# EAGLE schematic cs_debug_v1.1 (EAGLE 9.6.1)

## Sheet 1 of 3
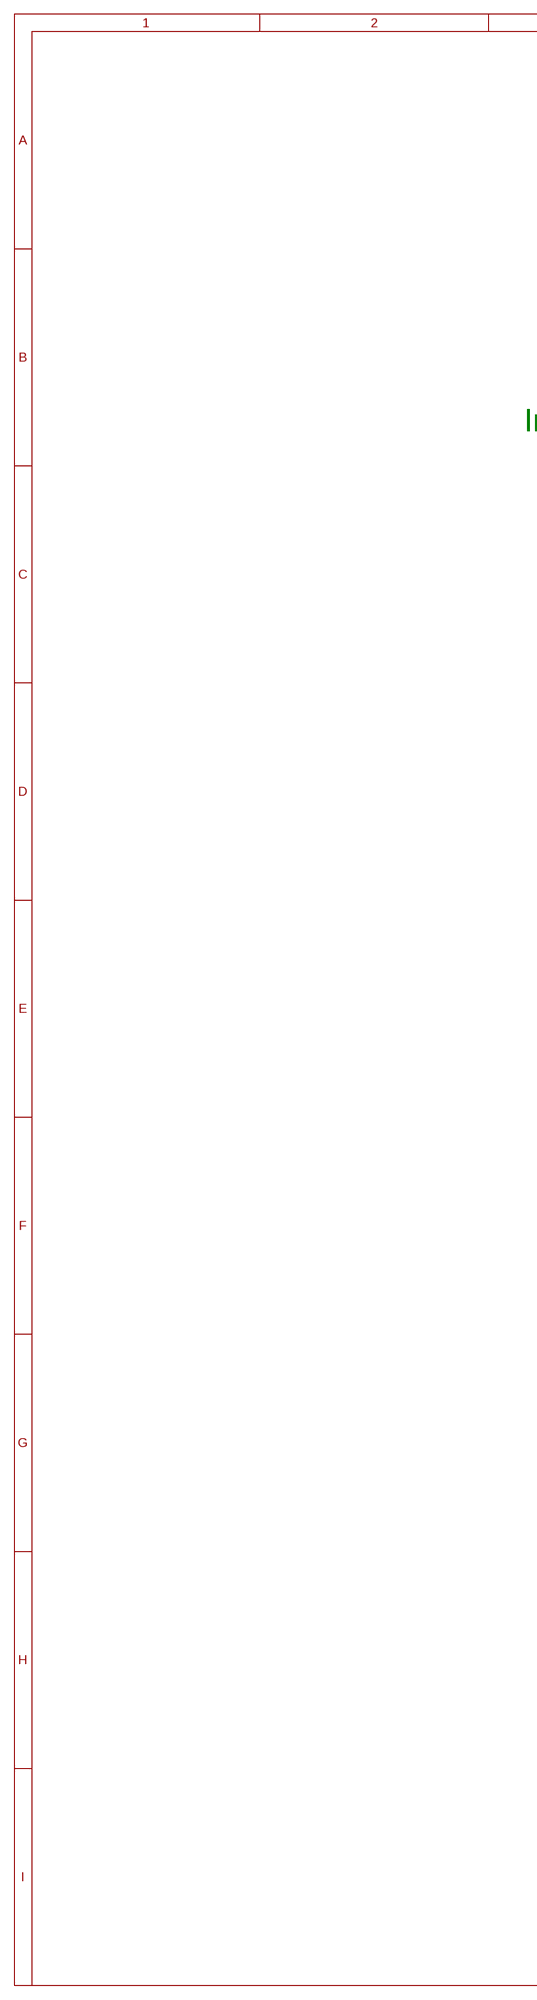
[diagram p0: schematic, sheet 1, part 1 of 3]
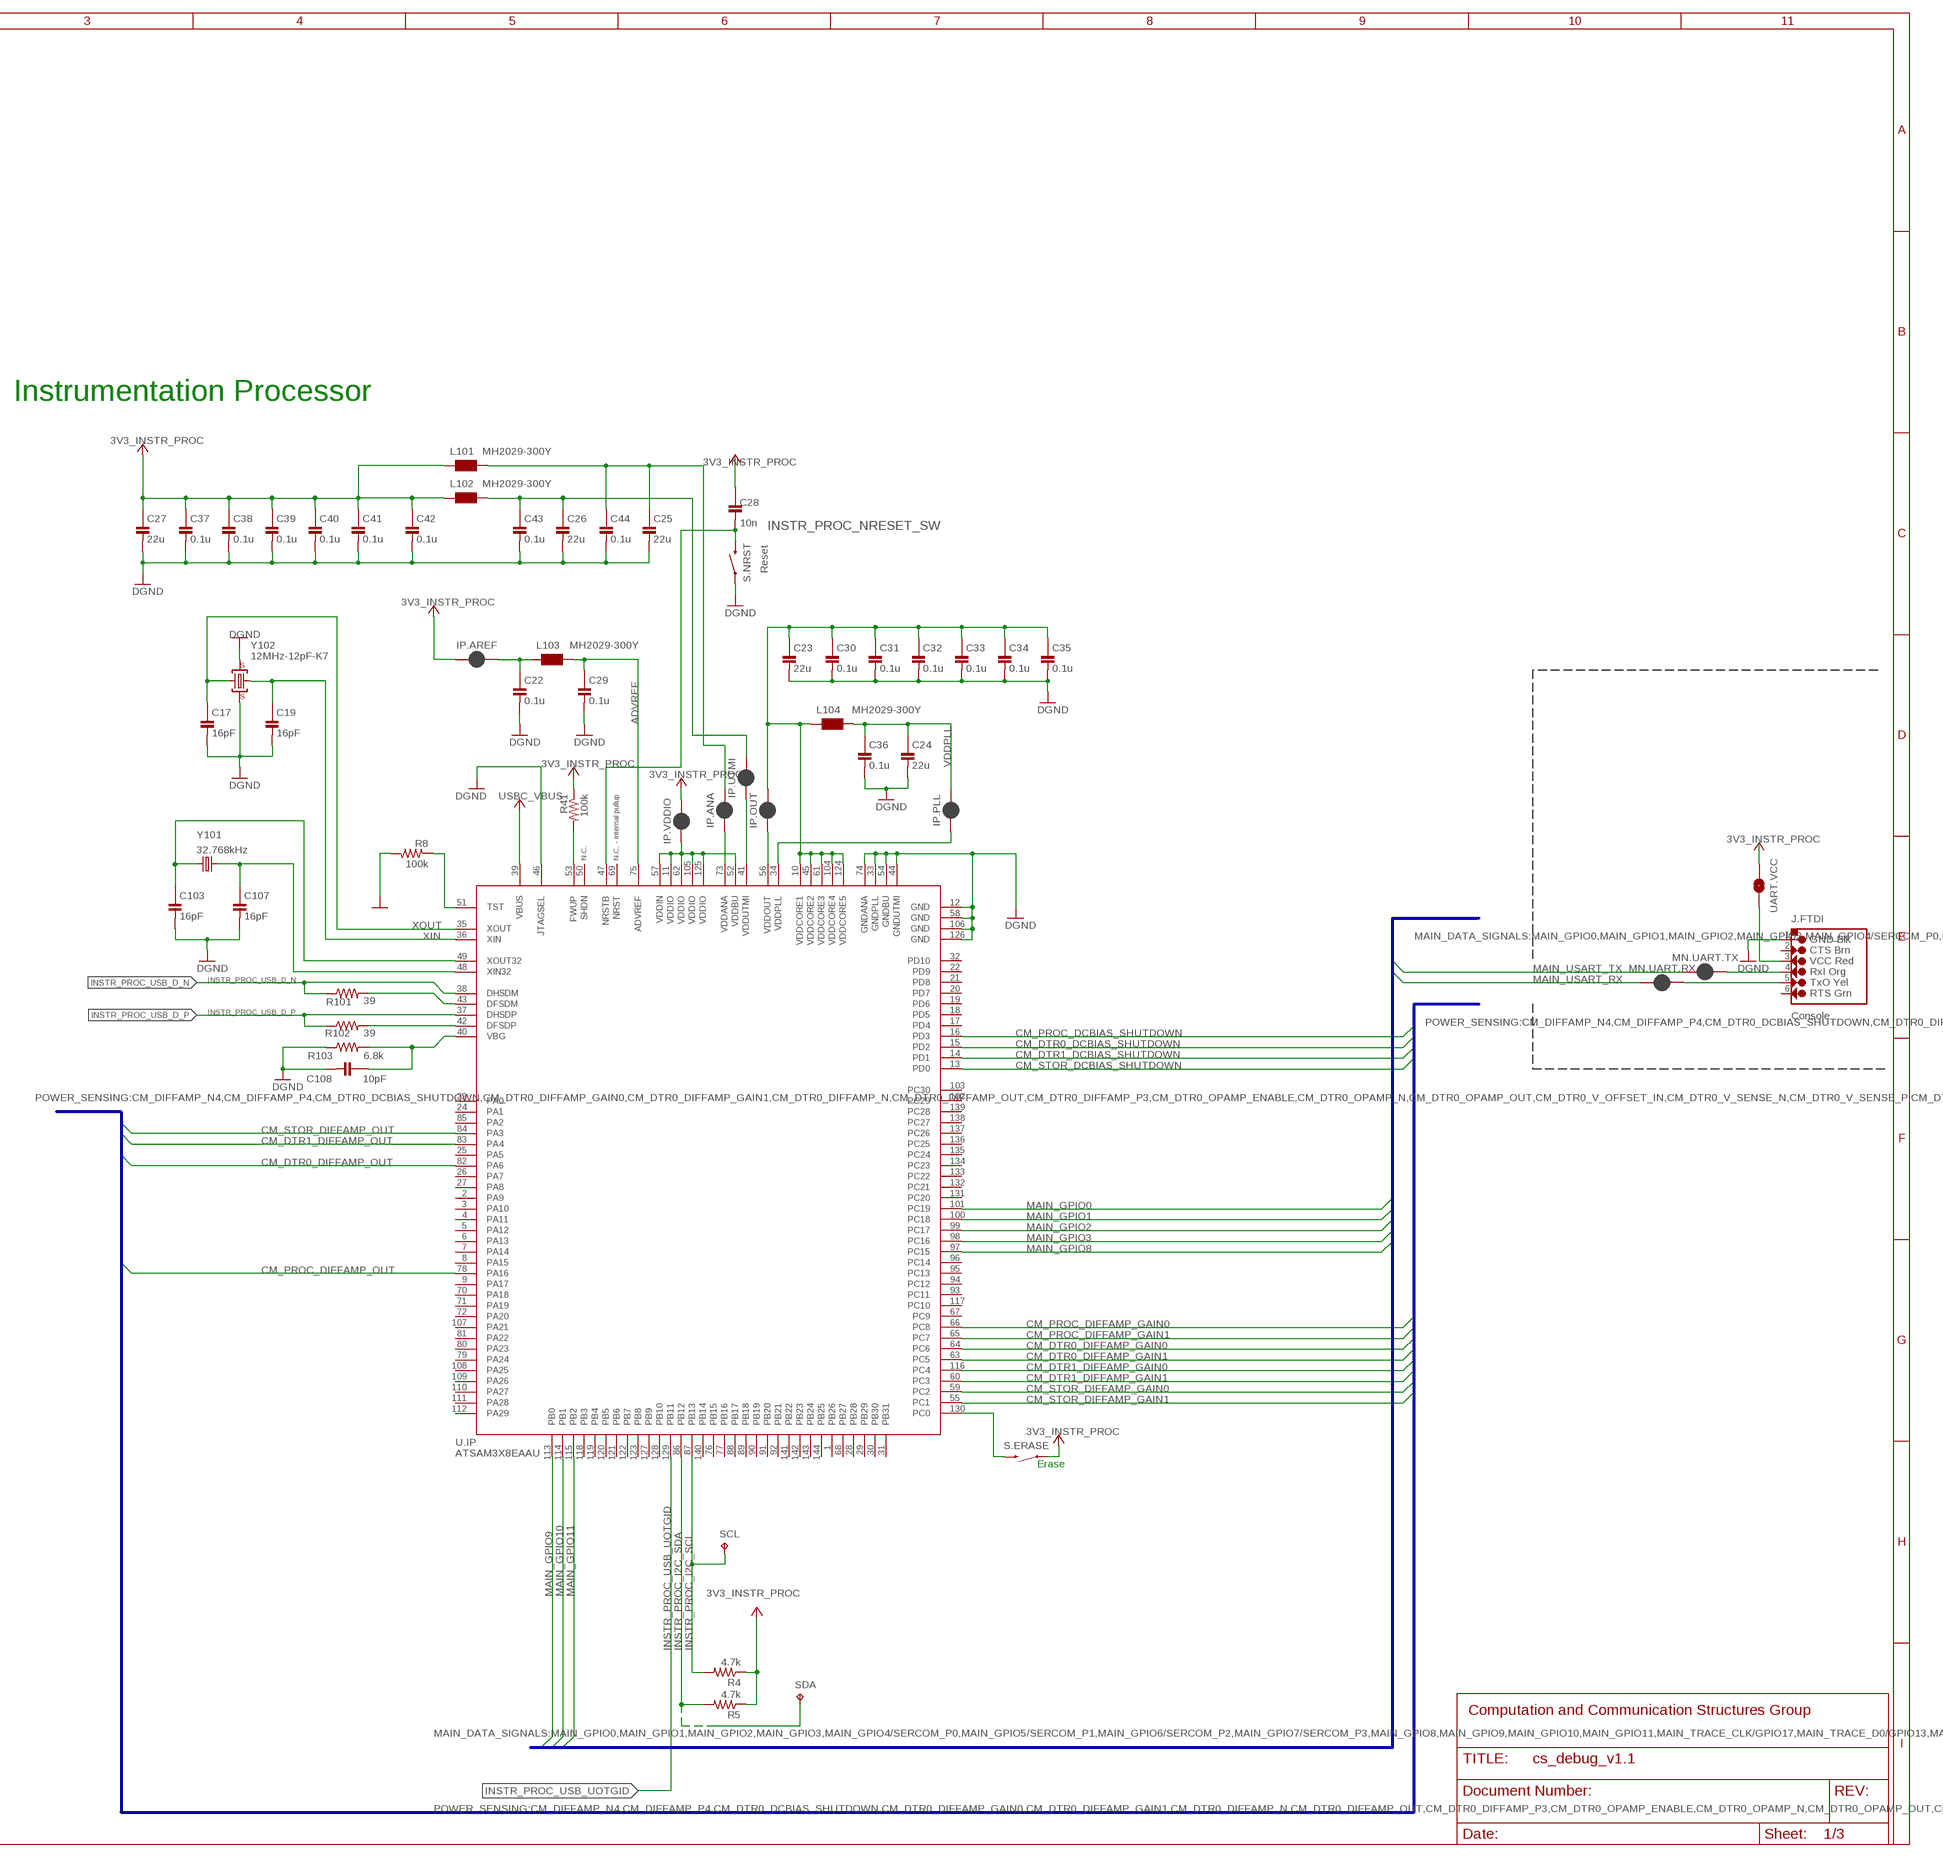
[diagram p1: schematic, sheet 1, part 2 of 3]
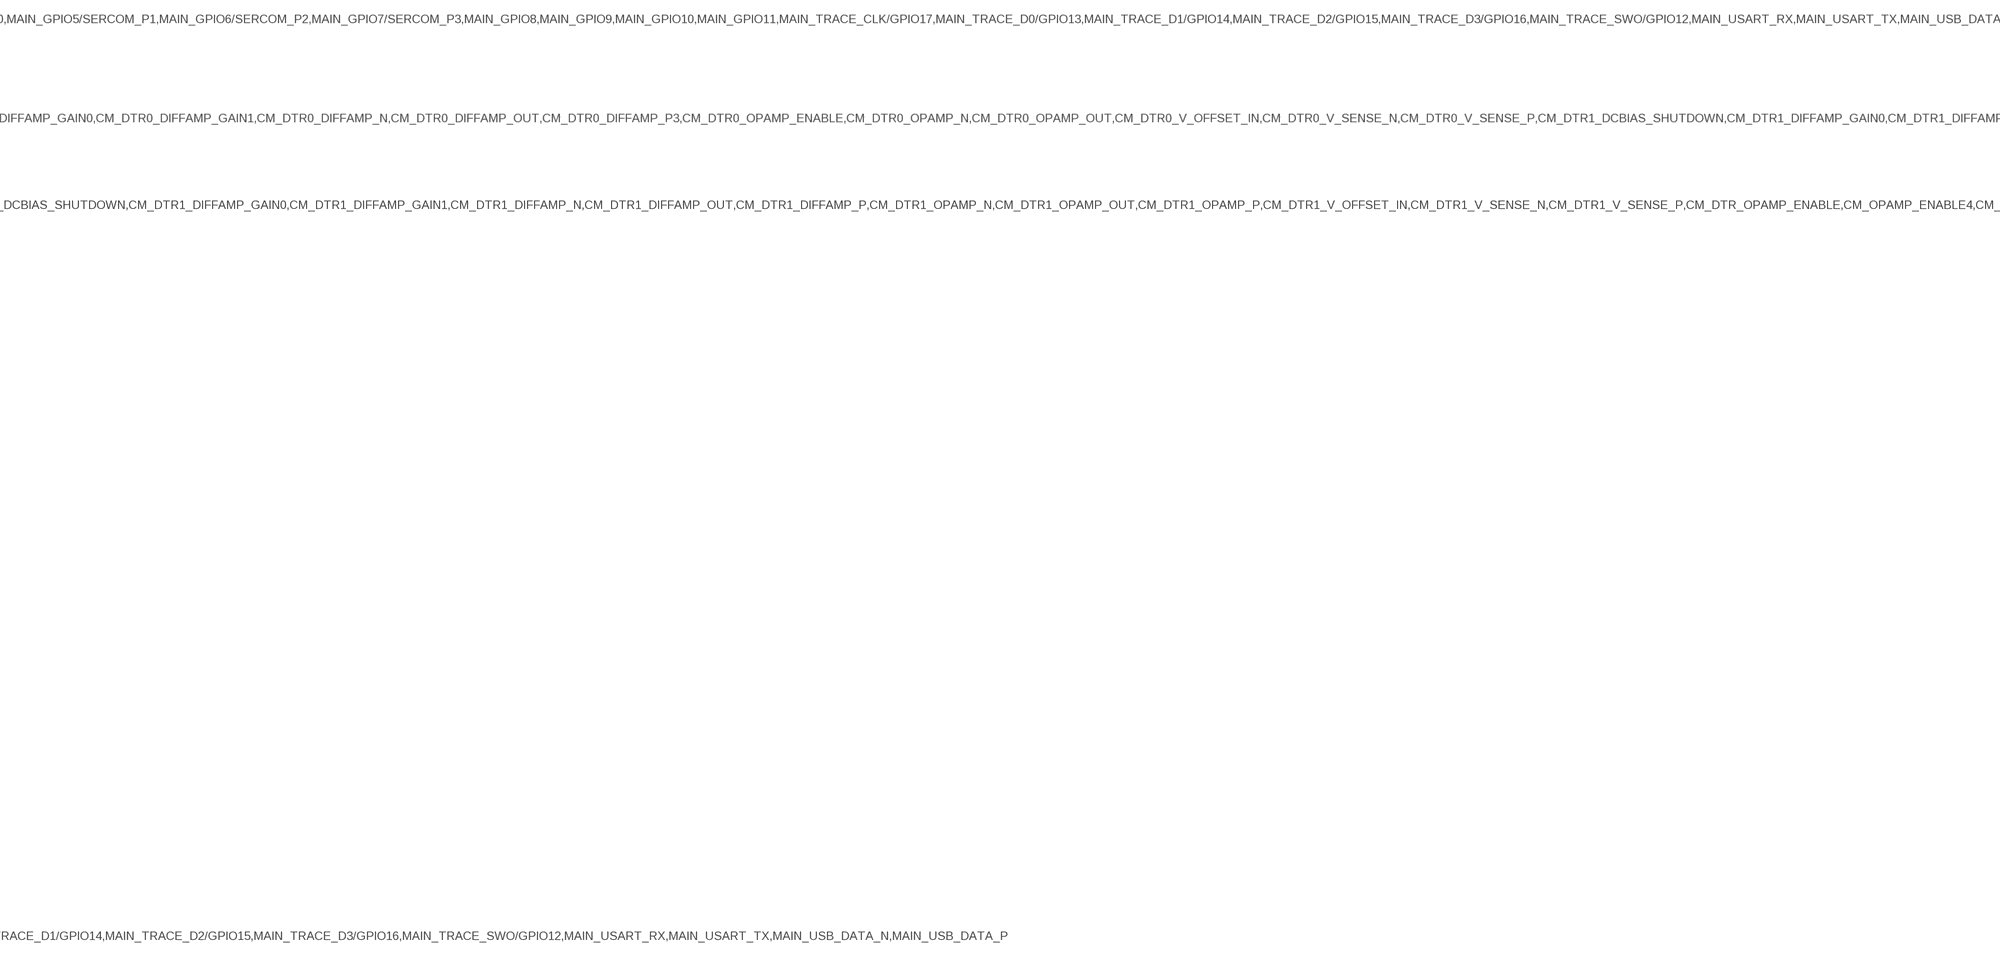
[diagram p2: schematic, sheet 1, part 3 of 3]

### Parts
C17  16pF  C-0603  [C0603]
C19  16pF  C-0603  [C0603]
C22  0.1u  C-0402  [C0402]
C23  22u  C-0805  [C0805]
C24  22u  C-0805  [C0805]
C25  22u  C-0805  [C0805]
C26  22u  C-0805  [C0805]
C27  22u  C-0805  [C0805]
C28  10n  C-0402  [C0402]
C29  0.1u  C-0402  [C0402]
C30  0.1u  C-0402  [C0402]
C31  0.1u  C-0402  [C0402]
C32  0.1u  C-0402  [C0402]
C33  0.1u  C-0402  [C0402]
C34  0.1u  C-0402  [C0402]
C35  0.1u  C-0402  [C0402]
C36  0.1u  C-0402  [C0402]
C37  0.1u  C-0402  [C0402]
C38  0.1u  C-0402  [C0402]
C39  0.1u  C-0402  [C0402]
C40  0.1u  C-0402  [C0402]
C41  0.1u  C-0402  [C0402]
C42  0.1u  C-0402  [C0402]
C43  0.1u  C-0402  [C0402]
C44  0.1u  C-0402  [C0402]
C103  16pF  C-0603  [C0603]
C107  16pF  C-0603  [C0603]
C108  10pF  C-0603  [C0603]
IP.ANA  JUMPER-SMT_2_NC_PASTE_NO-SILK  [SMT-JUMPER_2_NC_PASTE_NO-SILK]
IP.AREF  JUMPER-SMT_2_NC_PASTE_NO-SILK  [SMT-JUMPER_2_NC_PASTE_NO-SILK]
IP.OUT  JUMPER-SMT_2_NC_PASTE_NO-SILK  [SMT-JUMPER_2_NC_PASTE_NO-SILK]
IP.PLL  JUMPER-SMT_2_NC_PASTE_NO-SILK  [SMT-JUMPER_2_NC_PASTE_NO-SILK]
IP.UTMI  JUMPER-SMT_2_NC_PASTE_NO-SILK  [SMT-JUMPER_2_NC_PASTE_NO-SILK]
IP.VDDIO  JUMPER-SMT_2_NC_PASTE_NO-SILK  [SMT-JUMPER_2_NC_PASTE_NO-SILK]
J.FTDI  J-SERIAL-PORT  [HEADER-1X6]
L101  MH2029-300Y  [L0805]
L102  MH2029-300Y  [L0805]
L103  MH2029-300Y  [L0805]
L104  MH2029-300Y  [L0805]
MN.UART.RX  JUMPER-SMT_2_NC_PASTE_NO-SILK  [SMT-JUMPER_2_NC_PASTE_NO-SILK]
MN.UART.TX  JUMPER-SMT_2_NC_PASTE_NO-SILK  [SMT-JUMPER_2_NC_PASTE_NO-SILK]
R4  4.7k  R-0402  [R0402]
R5  4.7k  R-0402  [R0402]
R8  100k  R-0402  [R0402]
R41  100k  R-0402  [R0402]
R101  39  R-0402  [R0402]
R102  39  R-0402  [R0402]
R103  6.8k  R-0402  [R0402]
S.ERASE  Momentary  MOMENTARY-SWITCH-SPST-SMD-5.2MM  [TACTILE_SWITCH_SMD_5.2MM]
S.NRST  Momentary  MOMENTARY-SWITCH-SPST-SMD-5.2MM  [TACTILE_SWITCH_SMD_5.2MM]
SCL  TPTP10SQ  [TP10SQ]
SDA  TPTP10SQ  [TP10SQ]
U.IP  ATSAM3X8EA-AU  ATSAM3X8EAAU  [LQFP144]
UART.VCC  JUMPER-SMT_2_NO_PASTEFREE  [SMT-JUMPER_2_NO_PASTEFREE_NO-SILK]
Y101  32.768kHz  CRYSTAL3.2X1.5MM  [CRYSTAL-SMD-3.2X1.5MM]
Y102  12MHz-12pF-K7  0396_12MHZ-12PF-K7  [CRYSTAL-3.2-2.5]

### Nets
3V3_INSTR_PROC [power]: C27.1 C28.1 C37.1 C38.1 C39.1 C40.1 C41.1 C42.1 IP.AREF.1 IP.VDDIO.2 L101.1 L102.1 R4.1 R5.1 R41.1 S.ERASE.1 UART.VCC.1 ; supply symbol labelled +3V3 ; also sheet 2
ADVREF [power]: C29.1 L103.2 U.IP.75(ADVREF)
ADVREF_PRE [power]: C22.1 IP.AREF.2 L103.1
CM_DTR0_DCBIAS_SHUTDOWN: U.IP.15(PD2) ; also sheet 3
CM_DTR0_DIFFAMP_GAIN0: U.IP.64(PC6) ; also sheet 3
CM_DTR0_DIFFAMP_GAIN1: U.IP.63(PC5) ; also sheet 3
CM_DTR0_DIFFAMP_OUT: U.IP.82(PA6) ; also sheet 3
CM_DTR1_DCBIAS_SHUTDOWN: U.IP.14(PD1) ; also sheet 3
CM_DTR1_DIFFAMP_GAIN0: U.IP.116(PC4) ; also sheet 3
CM_DTR1_DIFFAMP_GAIN1: U.IP.60(PC3) ; also sheet 3
CM_DTR1_DIFFAMP_OUT: U.IP.83(PA4) ; also sheet 3
CM_PROC_DCBIAS_SHUTDOWN: U.IP.16(PD3) ; also sheet 3
CM_PROC_DIFFAMP_GAIN0: U.IP.66(PC8) ; also sheet 3
CM_PROC_DIFFAMP_GAIN1: U.IP.65(PC7) ; also sheet 3
CM_PROC_DIFFAMP_OUT: U.IP.78(PA16) ; also sheet 3
CM_STOR_DCBIAS_SHUTDOWN: U.IP.13(PD0) ; also sheet 3
CM_STOR_DIFFAMP_GAIN0: U.IP.59(PC2) ; also sheet 3
CM_STOR_DIFFAMP_GAIN1: U.IP.55(PC1) ; also sheet 3
CM_STOR_DIFFAMP_OUT: U.IP.84(PA3) ; also sheet 3
DGND [GND]: C17.2 C19.2 C22.2 C23.2 C24.2 C25.2 C26.2 C27.2 C29.2 C30.2 C31.2 C32.2 C33.2 C34.2 C35.2 C36.2 C37.2 C38.2 C39.2 C40.2 C41.2 C42.2 C43.2 C44.2 C103.2 C107.2 C108.2 J.FTDI.1(GND) R8.2 R103.1 S.NRST.1 U.IP.12(GND) U.IP.33(GNDPLL) U.IP.44(GNDUTMI) U.IP.46(JTAGSEL) U.IP.54(GNDBU) U.IP.58(GND) U.IP.74(GNDANA) U.IP.106(GND) U.IP.126(GND) Y102.2(GND) Y102.4(GND) ; supply symbol labelled GND ; also sheet 2
ERASE_S: S.ERASE.3 U.IP.130(PC0)
FWUP: R41.2 U.IP.53(FWUP)
INSTR_PROC_I2C_SCL: R4.2 SCL.TP U.IP.87(PB13) ; also sheet 3
INSTR_PROC_I2C_SDA: R5.2 SDA.TP U.IP.86(PB12) ; also sheet 3
INSTR_PROC_NRESET_SW: C28.2 S.NRST.3 U.IP.47(NRSTB)
INSTR_PROC_USB_D_N: R101.1 U.IP.38(DHSDM) ; also sheet 2
INSTR_PROC_USB_D_P: R102.1 U.IP.37(DHSDP) ; also sheet 2
INSTR_PROC_USB_UOTGID [power]: U.IP.129(PB11)
MAIN_GPIO0: U.IP.101(PC19) ; also sheet 2
MAIN_GPIO1: U.IP.100(PC18) ; also sheet 2
MAIN_GPIO2: U.IP.99(PC17) ; also sheet 2
MAIN_GPIO3: U.IP.98(PC16) ; also sheet 2
MAIN_GPIO8: U.IP.97(PC15) ; also sheet 2
MAIN_GPIO9: U.IP.113(PB0) ; also sheet 2
MAIN_GPIO10: U.IP.114(PB1) ; also sheet 2
MAIN_GPIO11: U.IP.115(PB2) ; also sheet 2
MAIN_USART_RX: MN.UART.RX.1 ; also sheet 2
MAIN_USART_TX: MN.UART.TX.1 ; also sheet 2
N$2: R102.2 U.IP.42(DFSDP)
N$7: J.FTDI.4(RX-I) MN.UART.TX.2
N$9: J.FTDI.5(TX-O) MN.UART.RX.2
N$11: J.FTDI.3(VCC-I) UART.VCC.2
N$13: R101.2 U.IP.43(DFSDM)
TST: R8.1 U.IP.51(TST)
USBC_VBUS [power]: U.IP.39(VBUS) ; supply symbol labelled +3V3 ; also sheet 2
VBG: C108.1 R103.2 U.IP.40(VBG)
VDDANA1 [power]: C25.1 C44.1 IP.ANA.2 L101.2
VDDANA_0 [power]: IP.ANA.1 U.IP.73(VDDANA)
VDDIO1 [power]: IP.VDDIO.1 U.IP.11(VDDIO) U.IP.52(VDDBU) U.IP.57(VDDIN) U.IP.62(VDDIO) U.IP.105(VDDIO) U.IP.125(VDDIO)
VDDOUT [power]: C23.1 C30.1 C31.1 C32.1 C33.1 C34.1 C35.1 IP.OUT.2 L104.1 U.IP.10(VDDCORE1) U.IP.45(VDDCORE2) U.IP.61(VDDCORE3) U.IP.104(VDDCORE4) U.IP.124(VDDCORE5)
VDDOUT_0 [power]: IP.OUT.1 U.IP.56(VDDOUT)
VDDOUTMI [power]: C26.1 C43.1 IP.UTMI.2 L102.2
VDDOUTMI_0 [power]: IP.UTMI.1 U.IP.41(VDDUTMI)
VDDPLL [power]: C24.1 C36.1 IP.PLL.2 L104.2
VDDPLL_0 [power]: IP.PLL.1 U.IP.34(VDDPLL)
XIN: C19.1 U.IP.36(XIN) Y102.1(C1)
XIN32: C107.1 U.IP.48(XIN32) Y101.P$1
XOUT: C17.1 U.IP.35(XOUT) Y102.3(C2)
XOUT32: C103.1 U.IP.49(XOUT32) Y101.P$2
Unconnected: J.FTDI.2(CTS-O) J.FTDI.6(RTS) U.IP.1(PB26) U.IP.2(PA9) U.IP.3(PA10) U.IP.4(PA11) U.IP.5(PA12) U.IP.6(PA13) U.IP.7(PA14) U.IP.8(PA15) U.IP.9(PA17) U.IP.17(PD4) U.IP.18(PD5) U.IP.19(PD6) U.IP.20(PD7) U.IP.21(PD8) U.IP.22(PD9) U.IP.23(PA0) U.IP.24(PA1) U.IP.25(PA5) U.IP.26(PA7) U.IP.27(PA8) U.IP.28(PB28) U.IP.29(PB29) U.IP.30(PB30) U.IP.31(PB31) U.IP.32(PD10) U.IP.50(SHDN) U.IP.67(PC9) U.IP.68(PB27) U.IP.69(NRST) U.IP.70(PA18) U.IP.71(PA19) U.IP.72(PA20) U.IP.76(PB15) U.IP.77(PB16) U.IP.79(PA24) U.IP.80(PA23) U.IP.81(PA22) U.IP.85(PA2) U.IP.88(PB17) U.IP.89(PB18) U.IP.90(PB19) U.IP.91(PB20) U.IP.92(PB21) U.IP.93(PC11) U.IP.94(PC12) U.IP.95(PC13) U.IP.96(PC14) U.IP.102(PC29) U.IP.103(PC30) U.IP.107(PA21) U.IP.108(PA25) U.IP.109(PA26) U.IP.110(PA27) U.IP.111(PA28) U.IP.112(PA29) U.IP.117(PC10) U.IP.118(PB3) U.IP.119(PB4) U.IP.120(PB5) U.IP.121(PB6) U.IP.122(PB7) U.IP.123(PB8) U.IP.127(PB9) U.IP.128(PB10) U.IP.131(PC20) U.IP.132(PC21) U.IP.133(PC22) U.IP.134(PC23) U.IP.135(PC24) U.IP.136(PC25) U.IP.137(PC26) U.IP.138(PC27) U.IP.139(PC28) U.IP.140(PB14) U.IP.141(PB22) U.IP.142(PB23) U.IP.143(PB24) U.IP.144(PB25)

### Buses
POWER_SENSING:CM_DIFFAMP_N4,CM_DIFFAMP_P4,CM_DTR0_DCBIAS_SHUTDOWN,CM_DTR0_DIFFAMP_GAIN0,CM_DTR0_DIFFAMP_GAIN1,CM_DTR0_DIFFAMP_N,CM_DTR0_DIFFAMP_OUT,CM_DTR0_DIFFAMP_P3,CM_DTR0_OPAMP_ENABLE,CM_DTR0_OPAMP_N,CM_DTR0_OPAMP_OUT,CM_DTR0_V_OFFSET_IN,CM_DTR0_V_SENSE_N,CM_DTR0_V_SENSE_P,CM_DTR1_DCBIAS_SHUTDOWN,CM_DTR1_DIFFAMP_GAIN0,CM_DTR1_DIFFAMP_GAIN1,CM_DTR1_DIFFAMP_N,CM_DTR1_DIFFAMP_OUT,CM_DTR1_DIFFAMP_P,CM_DTR1_OPAMP_N,CM_DTR1_OPAMP_OUT,CM_DTR1_OPAMP_P,CM_DTR1_V_OFFSET_IN,CM_DTR1_V_SENSE_N,CM_DTR1_V_SENSE_P,CM_DTR_OPAMP_ENABLE,CM_OPAMP_ENABLE4,CM_OPAMP_N4,CM_OPAMP_OUT4,CM_OPAMP_P1,CM_OPAMP_P3,CM_OPAMP_P4,CM_PROC_DCBIAS_SHUTDOWN,CM_PROC_DIFFAMP_GAIN0,CM_PROC_DIFFAMP_GAIN1,CM_PROC_DIFFAMP_OUT,CM_PROC_V_OFFSET_IN,CM_PROC_V_SENSE_N,CM_PROC_V_SENSE_P,CM_STOR_DCBIAS_SHUTDOWN,CM_STOR_DIFFAMP_GAIN0,CM_STOR_DIFFAMP_GAIN1,CM_STOR_DIFFAMP_N1,CM_STOR_DIFFAMP_OUT,CM_STOR_DIFFAMP_P1,CM_STOR_OPAMP_ENABLE,CM_STOR_OPAMP_N,CM_STOR_OPAMP_OUT,CM_STOR_V_OFFSET_IN,CM_STOR_V_SENSE_N,CM_STOR_V_SENSE_P,V_SENSE_P
MAIN_DATA_SIGNALS:MAIN_GPIO0,MAIN_GPIO1,MAIN_GPIO2,MAIN_GPIO3,MAIN_GPIO4/SERCOM_P0,MAIN_GPIO5/SERCOM_P1,MAIN_GPIO6/SERCOM_P2,MAIN_GPIO7/SERCOM_P3,MAIN_GPIO8,MAIN_GPIO9,MAIN_GPIO10,MAIN_GPIO11,MAIN_TRACE_CLK/GPIO17,MAIN_TRACE_D0/GPIO13,MAIN_TRACE_D1/GPIO14,MAIN_TRACE_D2/GPIO15,MAIN_TRACE_D3/GPIO16,MAIN_TRACE_SWO/GPIO12,MAIN_USART_RX,MAIN_USART_TX,MAIN_USB_DATA_N,MAIN_USB_DATA_P

### Notes on the sheet
- Instrumentation Processor
- Reset
- N.C. | N.C. - internal pullup
- Erase
- Computation and Communication Structures Group

## Sheet 2 of 3
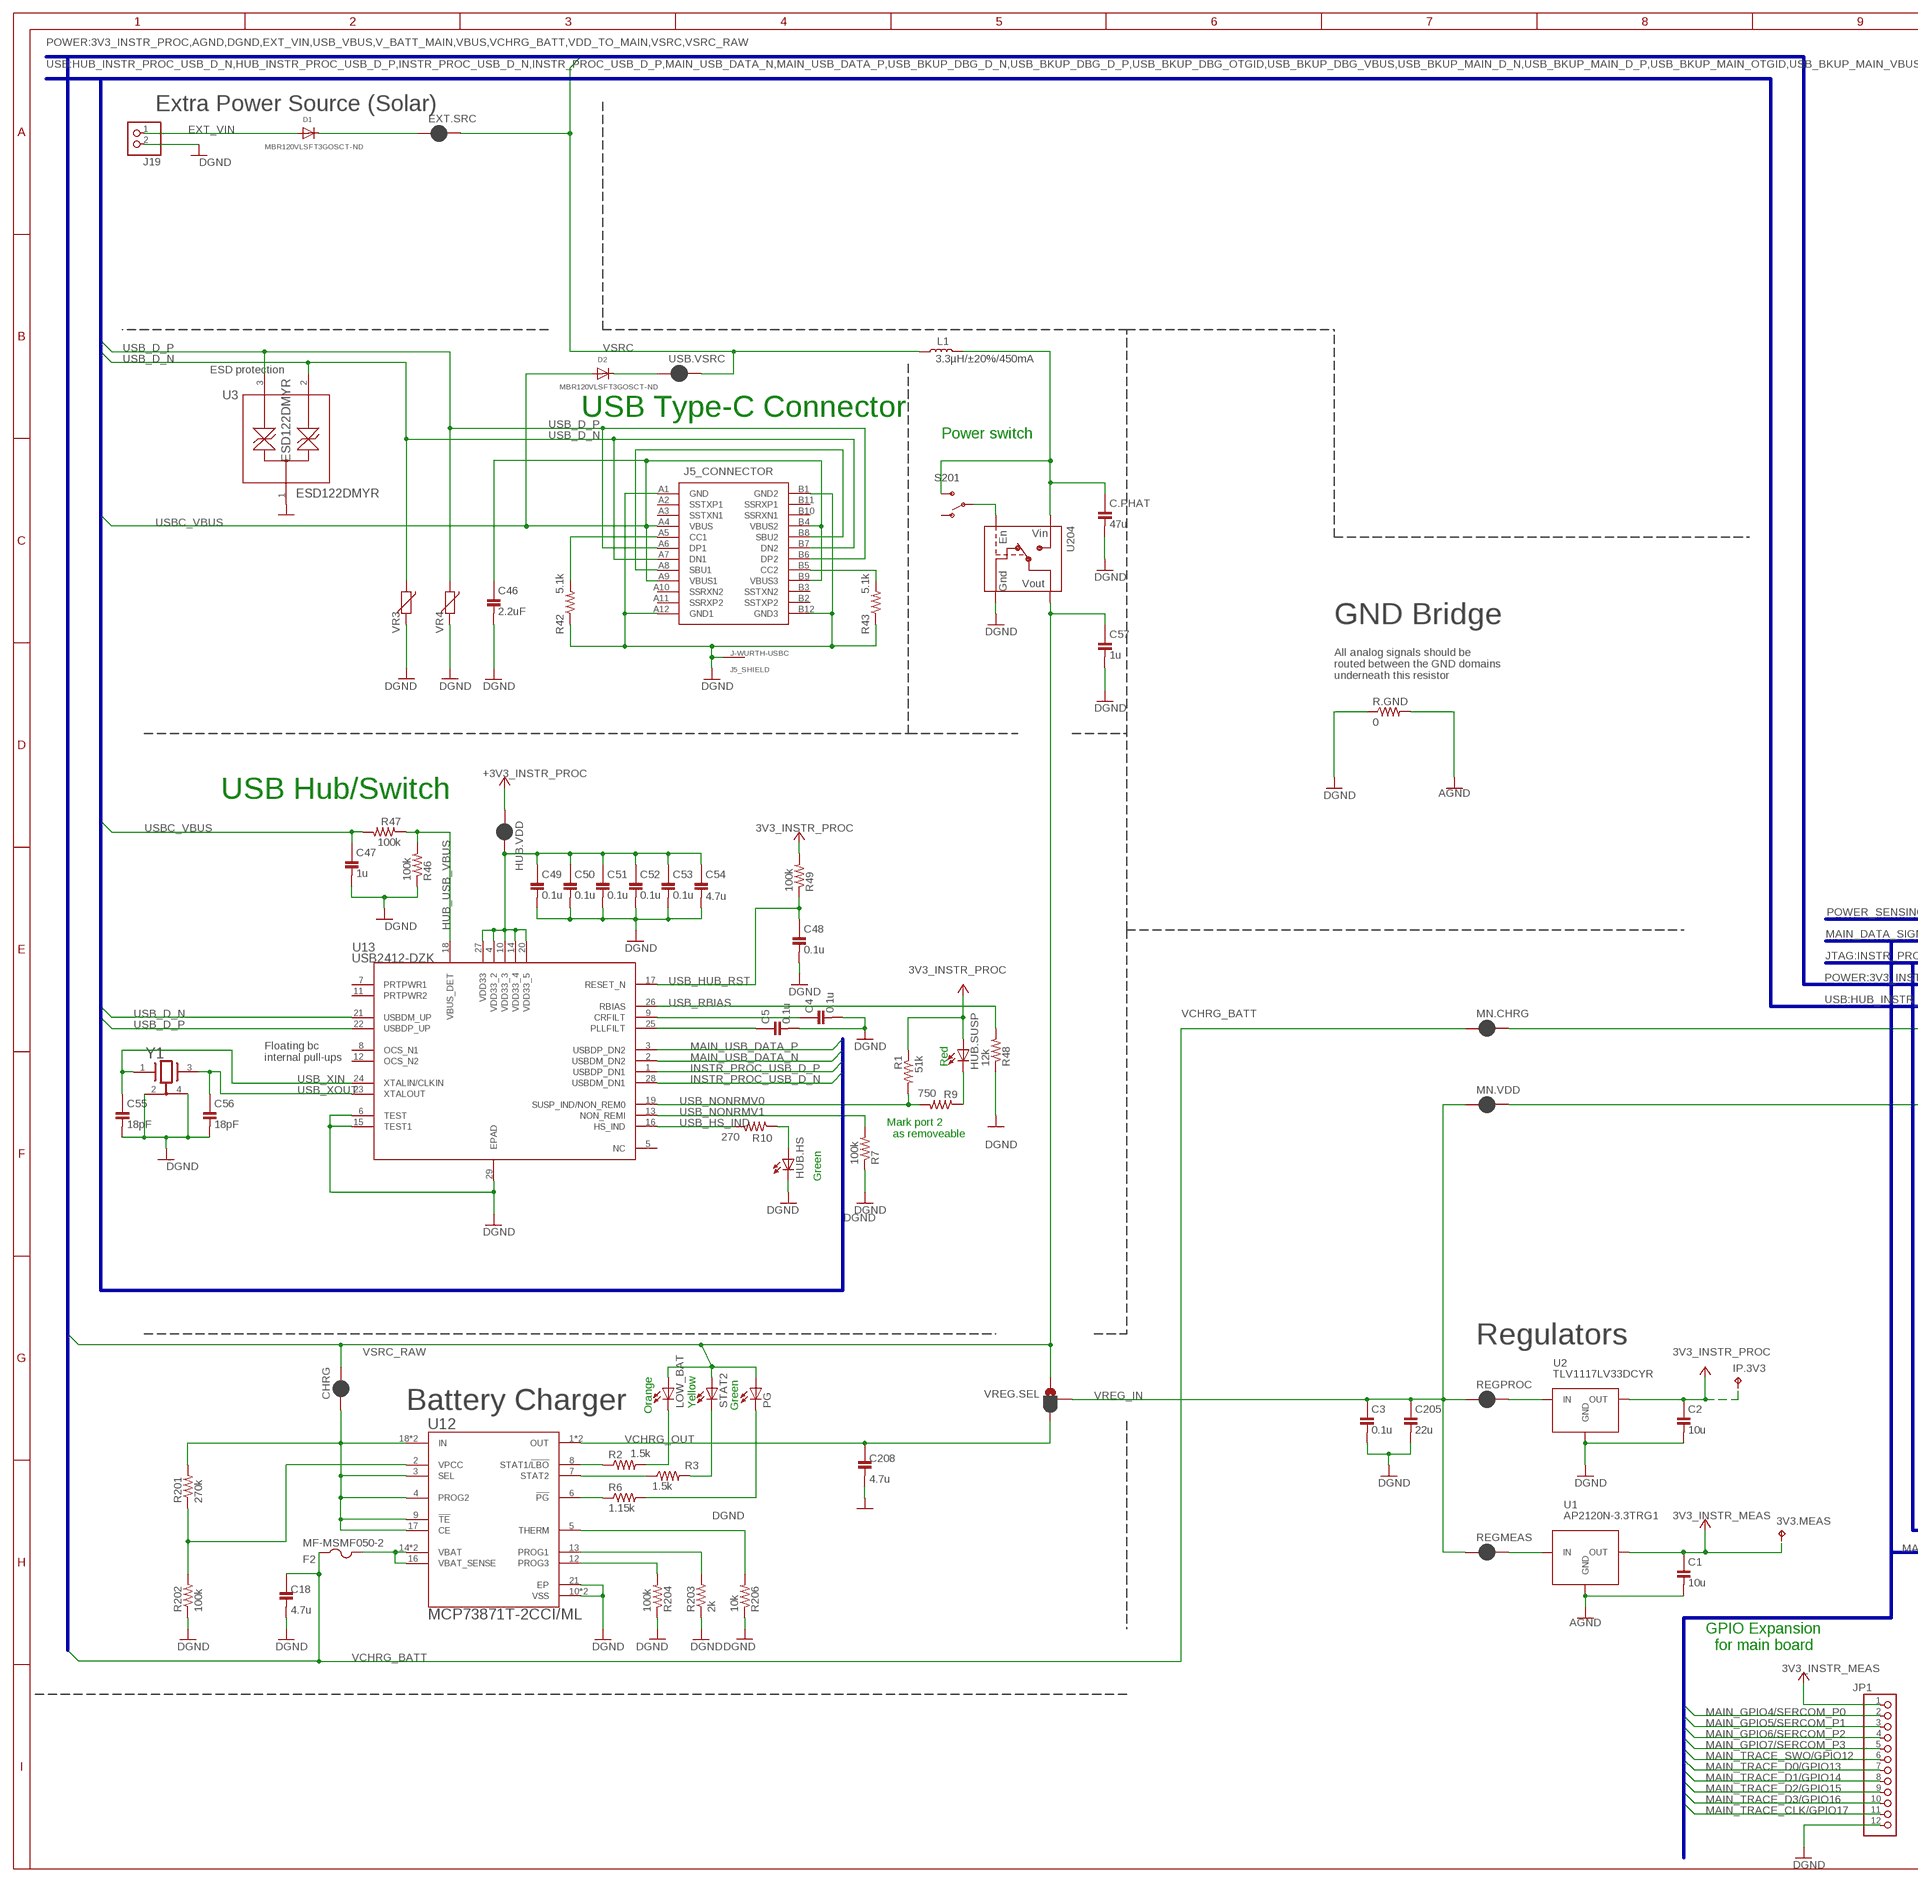
[diagram p3: schematic, sheet 2, part 1 of 2]
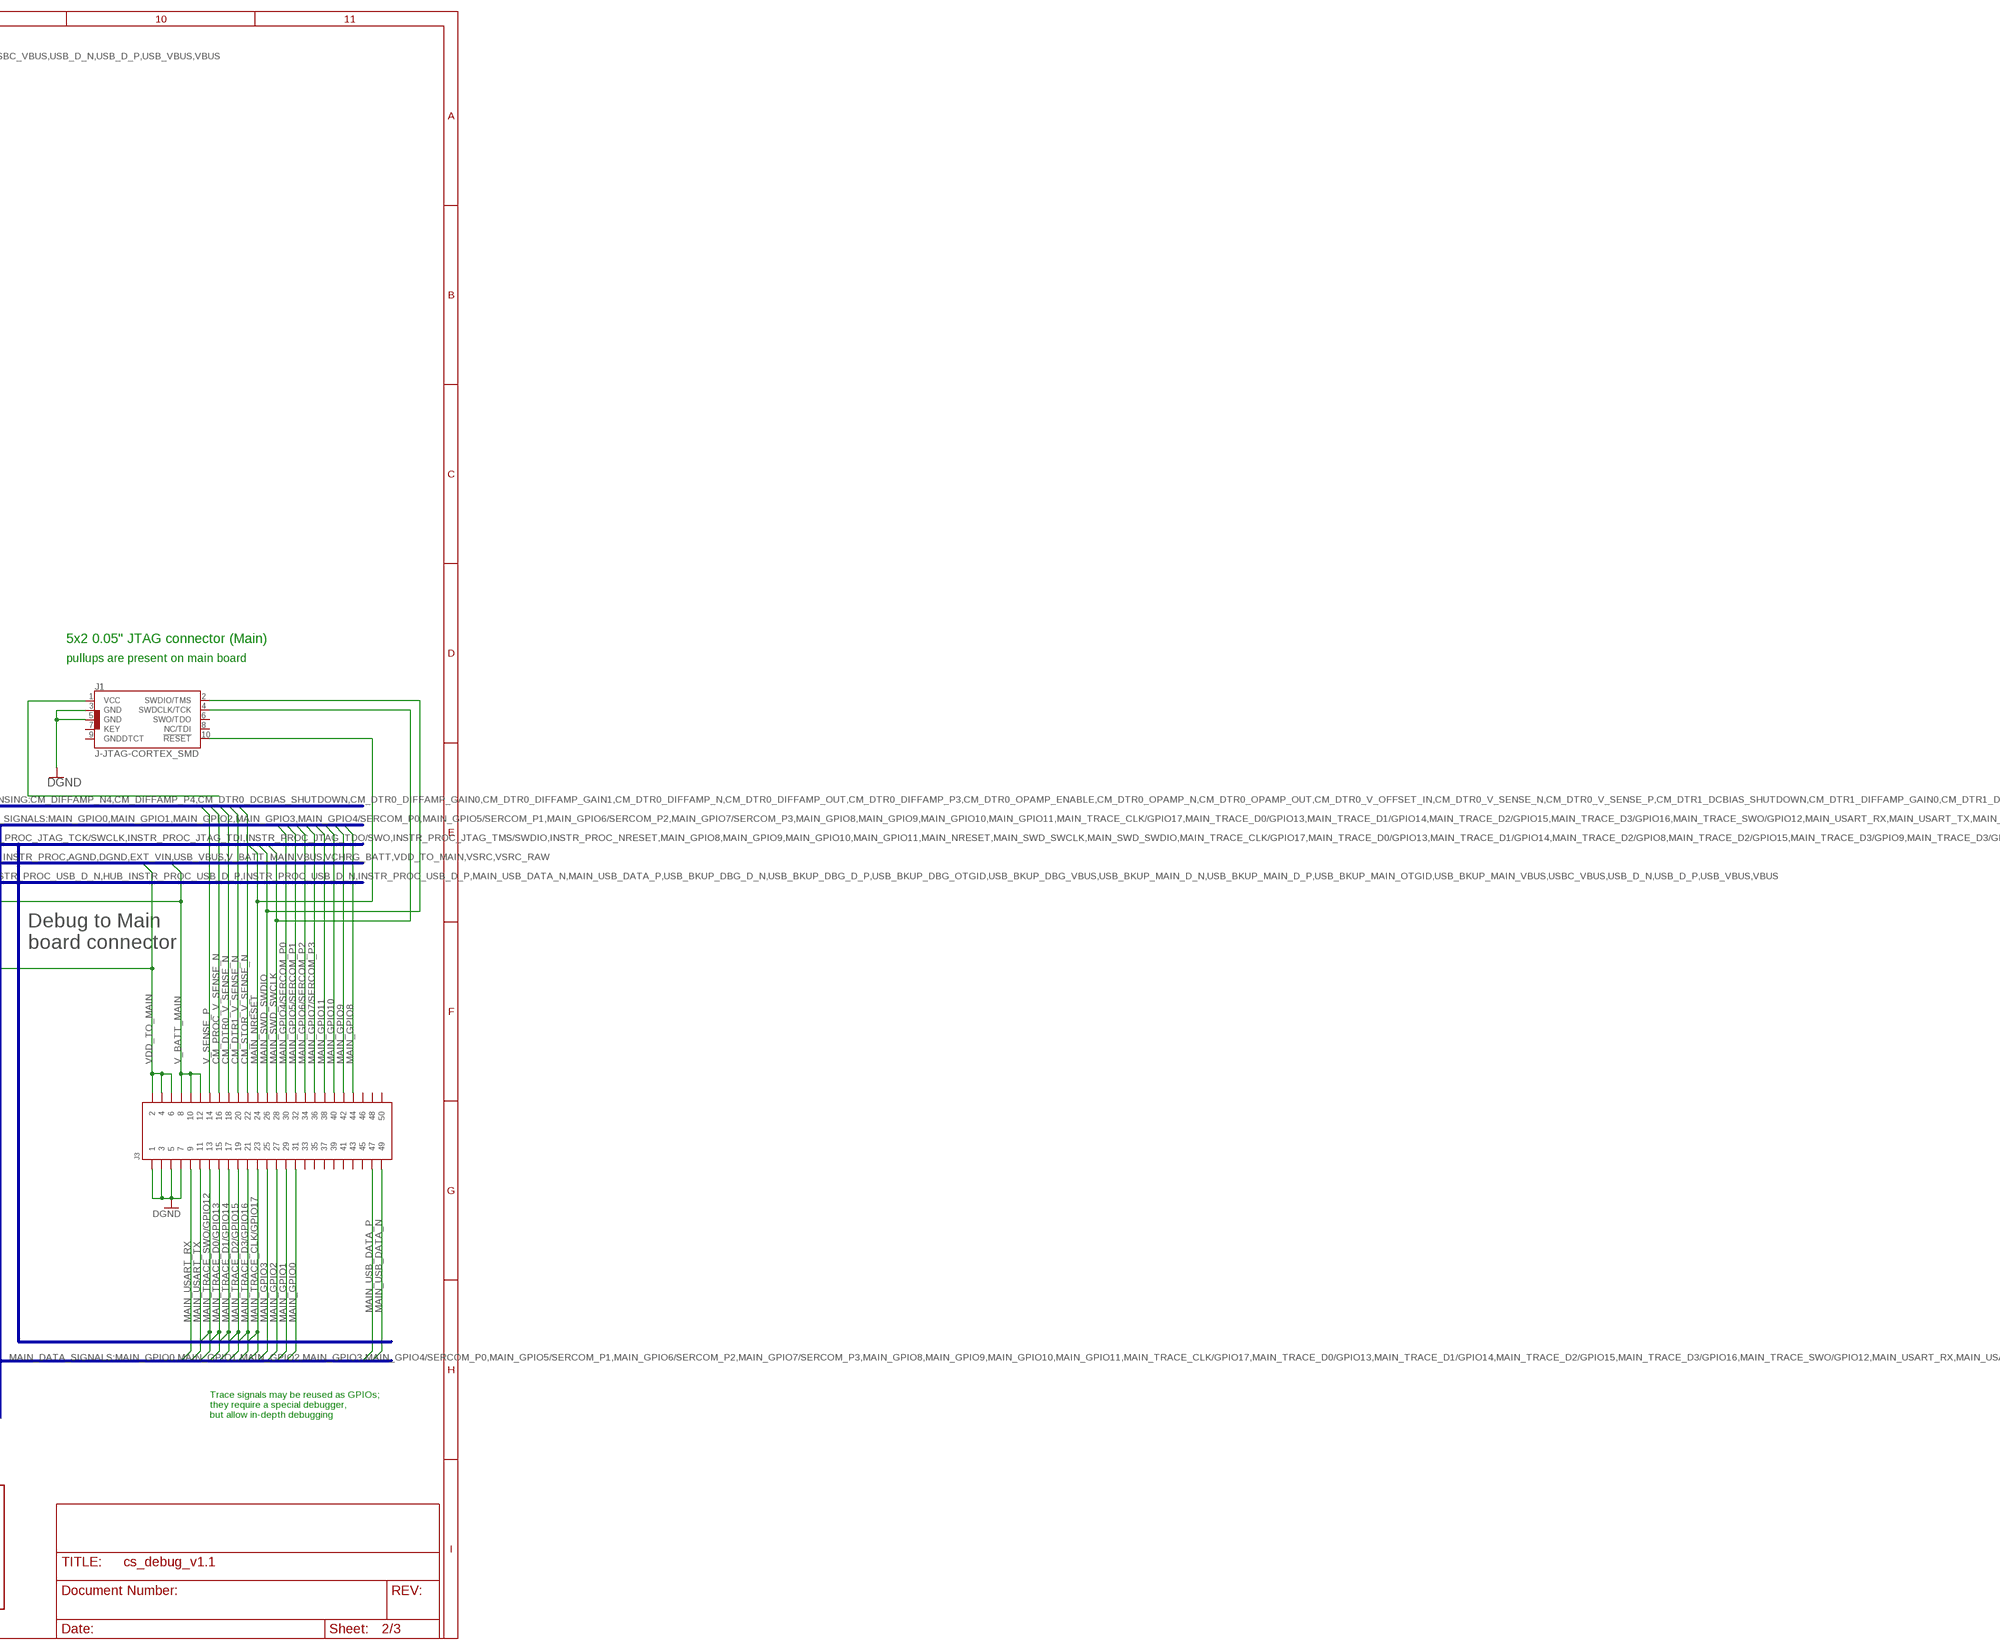
[diagram p4: schematic, sheet 2, part 2 of 2]

### Parts
3V3.MEAS  TPTP10SQ  [TP10SQ]
C1  10u  C-0805  [C0805]
C2  10u  C-0805  [C0805]
C3  0.1u  C-0402  [C0402]
C4  0.1u  C-0402  [C0402]
C5  0.1u  C-0402  [C0402]
C18  4.7u  C-0603  [C0603]
C46  2.2uF  C-0603  [C0603]
C47  1u  C-0402  [C0402]
C48  0.1u  C-0402  [C0402]
C49  0.1u  C-0402  [C0402]
C50  0.1u  C-0402  [C0402]
C51  0.1u  C-0402  [C0402]
C52  0.1u  C-0402  [C0402]
C53  0.1u  C-0402  [C0402]
C54  4.7u  C-0603  [C0603]
C55  18pF  C-0402  [C0402]
C56  18pF  C-0402  [C0402]
C57  1u  C-0402  [C0402]
C205  22u  C-0805  [C0805]
C208  4.7u  C-0603  [C0603]
C.PHAT  47u  C-1206  [C1206]
CHRG  JUMPER-SMT_2_NC_PASTE_NO-SILK  [SMT-JUMPER_2_NC_PASTE_NO-SILK]
D1  MBR120VLSFT3GOSCT-ND  DIODESOD-123  [SOD-123]
D2  MBR120VLSFT3GOSCT-ND  DIODESOD-123  [SOD-123]
EXT.SRC  JUMPER-SMT_2_NC_PASTE_NO-SILK  [SMT-JUMPER_2_NC_PASTE_NO-SILK]
F2  MF-MSMF050-2  PTCFUSE-1812  [1812]
HUB.HS  LEDCHIPLED_0603  [CHIPLED_0603]
HUB.SUSP  LEDCHIPLED_0603  [CHIPLED_0603]
HUB.VDD  JUMPER-SMT_2_NC_PASTE_NO-SILK  [SMT-JUMPER_2_NC_PASTE_NO-SILK]
IP.3V3  TPTP10SQ  [TP10SQ]
J1  J-JTAG-CORTEX_SMD  [SAMTECH_FTSH-105-01]
J3  HIROSE-DF40_50-PIN_CONNECTORS-HEADER  [HRS_DF40C-50DP-0.4V(51)]
J5  J-WURTH-USBC  [632723X00011]
J19  Solar  J-JST2-SMT-RA  [JST-PH-2-SMT-RA]
JP1  J-HEADER-1X12  [1X12_ROUND]
L1  3.3µH/±20%/450mA  INDUCTOR-0805-3.3UH  [0805]
LOW_BAT  LEDCHIPLED_0603  [CHIPLED_0603]
MN.CHRG  JUMPER-SMT_2_NC_PASTE_NO-SILK  [SMT-JUMPER_2_NC_PASTE_NO-SILK]
MN.VDD  JUMPER-SMT_2_NC_PASTE_NO-SILK  [SMT-JUMPER_2_NC_PASTE_NO-SILK]
PG  LEDCHIPLED_0603  [CHIPLED_0603]
R1  51k  R-0402  [R0402]
R2  1.5k  R-0402  [R0402]
R3  1.5k  R-0402  [R0402]
R6  1.15k  R-0402  [R0402]
R7  100k  R-0402  [R0402]
R9  750  R-0402  [R0402]
R10  270  R-0402  [R0402]
R42  5.1k  R-0603  [R0603]
R43  5.1k  R-0603  [R0603]
R46  100k  R-0402  [R0402]
R47  100k  R-0402  [R0402]
R48  12k  R-0402  [R0402]
R49  100k  R-0402  [R0402]
R201  270k  R-0402  [R0402]
R202  100k  R-0402  [R0402]
R203  2k  R-0402  [R0402]
R204  100k  R-0402  [R0402]
R206  10k  R-0402  [R0402]
R.GND  0  R-2010  [R2010]
REGMEAS  JUMPER-SMT_2_NC_PASTE_NO-SILK  [SMT-JUMPER_2_NC_PASTE_NO-SILK]
REGPROC  JUMPER-SMT_2_NC_PASTE_NO-SILK  [SMT-JUMPER_2_NC_PASTE_NO-SILK]
S201  SLIDESWITCH-SPDT-SMD-RIGHT-ANGLE  [SWITCH_SPST_SMD_A]
STAT2  LEDCHIPLED_0603  [CHIPLED_0603]
U1  AP2120N-3.3TRG1  AP2120N  [SOT23-3_AP2120N]
U2  TLV1117LV33DCYR  [DCY4]
U3  ESD122DMYR  [DMY0003A]
U12  MCP73871T-2CCI/ML  [QFN50P400X400X100-21N]
U13  USB2412-DZK  [QFN28_5X5MC_MCH]
U204  LOADSWITCH-MIC94164  [WLCSP6_2X3]
USB.VSRC  JUMPER-SMT_2_NC_PASTE_NO-SILK  [SMT-JUMPER_2_NC_PASTE_NO-SILK]
VR3  VARISTOR  [R0603]
VR4  VARISTOR  [R0603]
VREG.SEL  JUMPER-SMT_3_1-NC_PASTE_NO-SILK  [SMT-JUMPER_3_1-NC_PASTE_NO-SILK]
Y1  EPSON_TSX-3225_24.0000MF10Z-C3  [XTAL_EPSON_TSX3225]

### Nets
3V3_INSTR_MEAS [power]: 3V3.MEAS.TP C1.1 JP1.1 U1.OUT ; supply symbol labelled +3V3 ; also sheet 3
3V3_INSTR_PROC [power]: C2.1 HUB.SUSP.A IP.3V3.TP R1.1 R49.2 U2.OUT U2.OUT_TAB(OUT) ; supply symbol labelled +3V3 ; also sheet 1
+3V3_INSTR_PROC [power]: HUB.VDD.1 ; supply symbol labelled +3V3
AGND [GND]: C1.2 R.GND.2 U1.GND ; also sheet 3
BAT_CHG_PROG1: R203.2 U12.13(PROG1)
CC3: J5.A5(_CONNECTOR:CC1) R42.2
CC4: J5.B5(_CONNECTOR:CC2) R43.2
CHG_VPCC [power]: R201.1 R202.2 U12.2(VPCC)
CM_DTR0_V_SENSE_N: J3.18 ; also sheet 3
CM_DTR1_V_SENSE_N: J3.20 ; also sheet 3
CM_PROC_V_SENSE_N: J3.16 ; also sheet 3
CM_STOR_V_SENSE_N: J3.22 ; also sheet 3
DGND [GND]: C2.2 C3.2 C4.2 C5.2 C18.2 C46.2 C47.2 C48.2 C49.2 C50.2 C51.2 C52.2 C53.2 C54.2 C55.2 C56.2 C57.2 C205.2 C208.2 C.PHAT.2 HUB.HS.C J1.3(GND) J1.5(GND) J3.1 J3.3 J3.5 J3.7 J5.A1(_CONNECTOR:GND) J5.A12(_CONNECTOR:GND1) J5.B1(_CONNECTOR:GND2) J5.B12(_CONNECTOR:GND3) J5.GND1(_SHIELD:SHIELD) J5.GND(_SHIELD:SHIELD) J5.Z1(_SHIELD:SHIELD) J5.Z2(_SHIELD:SHIELD) J5.Z3(_SHIELD:SHIELD) J5.Z4(_SHIELD:SHIELD) J5.Z5(_SHIELD:SHIELD) J5.Z6(_SHIELD:SHIELD) J19.2 JP1.12 R7.1 R42.1 R43.1 R46.1 R48.1 R202.1 R203.1 R204.1 R206.1 R.GND.1 U2.GND U3.1(GND) U12.10(VSS) U12.11(VSS) U12.21(EP) U13.6(TEST) U13.15(TEST1) U13.29(EPAD) U204.C1(GND) VR3.2 VR4.2 Y1.2(1_GND) Y1.4(2_GND) ; supply symbol labelled GND ; also sheet 1
EXT_VIN [power]: D1.A J19.1
HUB_USB_VBUS: R46.2 R47.1 U13.18(VBUS_DET)
INSTR_PROC_USB_D_N: U13.28(USBDM_DN1) ; also sheet 1
INSTR_PROC_USB_D_P: U13.1(USBDP_DN1) ; also sheet 1
MAIN_GPIO0: J3.31 ; also sheet 1
MAIN_GPIO1: J3.29 ; also sheet 1
MAIN_GPIO2: J3.27 ; also sheet 1
MAIN_GPIO3: J3.25 ; also sheet 1
MAIN_GPIO4/SERCOM_P0: J3.30 JP1.2
MAIN_GPIO5/SERCOM_P1: J3.32 JP1.3
MAIN_GPIO6/SERCOM_P2: J3.34 JP1.4
MAIN_GPIO7/SERCOM_P3: J3.36 JP1.5
MAIN_GPIO8: J3.44 ; also sheet 1
MAIN_GPIO9: J3.42 ; also sheet 1
MAIN_GPIO10: J3.40 ; also sheet 1
MAIN_GPIO11: J3.38 ; also sheet 1
MAIN_NRESET: J1.10(!RESET) J3.24
MAIN_SWD_SWCLK: J1.4(SWDCLK/TCK) J3.28
MAIN_SWD_SWDIO: J1.2(SWDIO/TMS) J3.26
MAIN_TRACE_CLK/GPIO17: J3.23 JP1.11
MAIN_TRACE_D0/GPIO13: J3.15 JP1.7
MAIN_TRACE_D1/GPIO14: J3.17 JP1.8
MAIN_TRACE_D2/GPIO15: J3.19 JP1.9
MAIN_TRACE_D3/GPIO16: J3.21 JP1.10
MAIN_TRACE_SWO/GPIO12: J3.13 JP1.6
MAIN_USART_RX: J3.9 ; also sheet 1
MAIN_USART_TX: J3.11 ; also sheet 1
MAIN_USB_DATA_N: J3.49 U13.2(USBDM_DN2)
MAIN_USB_DATA_P: J3.47 U13.3(USBDP_DN2)
N$1 [power]: REGMEAS.2 U1.IN
N$3: HUB.SUSP.C R9.1
N$4 [power]: REGPROC.2 U2.IN
N$5: LOW_BAT.C R2.2
N$8: F2.2 U12.14(VBAT) U12.15(VBAT) U12.16(VBAT_SENSE)
N$10: R204.2 U12.12(PROG3)
N$12: R2.1 U12.8(STAT1/!LBO)
N$14: R3.1 U12.7(STAT2)
N$15 [power]: D1.C EXT.SRC.1
N$16: C4.1 U13.9(CRFILT)
N$17: C5.1 U13.25(PLLFILT)
N$18: R3.2 STAT2.C
N$19: PG.C R6.2
N$20: R6.1 U12.6(!PG)
N$23: HUB.HS.A R10.1
N$24 [power]: CHRG.1 R201.2 U12.3(SEL) U12.4(PROG2) U12.9(!TE) U12.17(CE) U12.18(IN) U12.19(IN)
THERM: R206.2 U12.5(THERM)
UCTX_DBGRX: J5.A8(_CONNECTOR:SBU1) J5.B8(_CONNECTOR:SBU2)
USB_D_N: J5.A7(_CONNECTOR:DN1) J5.B7(_CONNECTOR:DN2) U3.2(IO2) U13.21(USBDM_UP) VR3.1
USB_D_P: J5.A6(_CONNECTOR:DP1) J5.B6(_CONNECTOR:DP2) U3.3(IO1) U13.22(USBDP_UP) VR4.1
USB_HS_IND: R10.2 U13.16(HS_IND)
USB_HUB_RST: C48.1 R49.1 U13.17(RESET_N)
USB_HUB_VDD [power]: C49.1 C50.1 C51.1 C52.1 C53.1 C54.1 HUB.VDD.2 U13.4(VDD33_2) U13.10(VDD33_3) U13.14(VDD33_4) U13.20(VDD33_5) U13.27(VDD33)
USB_NONRMV0: R1.2 R9.2 U13.19(SUSP_IND/NON_REM0)
USB_NONRMV1: R7.2 U13.13(NON_REMI)
USB_RBIAS: R48.2 U13.26(RBIAS)
USB_XIN: C55.1 U13.24(XTALIN/CLKIN) Y1.1
USB_XOUT: C56.1 U13.23(XTALOUT) Y1.3
USBC_VBUS [power]: C46.1 C47.1 D2.A J5.A4(_CONNECTOR:VBUS) J5.A9(_CONNECTOR:VBUS1) J5.B4(_CONNECTOR:VBUS2) J5.B9(_CONNECTOR:VBUS3) R47.2 ; also sheet 1
V_BATT_MAIN [power]: J3.8 J3.10 J3.12 MN.CHRG.2
V_SENSE_P: J1.1(VCC) J3.14 ; also sheet 3
VCHRG_BATT [power]: C18.1 F2.1 MN.CHRG.1
VCHRG_OUT [power]: C208.1 U12.1(OUT) U12.20(OUT) VREG.SEL.3
VDD_TO_MAIN [power]: J3.2 J3.4 J3.6 MN.VDD.2
VREG.SW.EN: S201.2(P) U204.C2(ENABLE)
VREG_IN [power]: C3.1 C205.1 MN.VDD.1 REGMEAS.1 REGPROC.1 VREG.SEL.2
VSRC [power]: EXT.SRC.2 L1.1 USB.VSRC.2
VSRC_RAW [power]: C57.1 CHRG.2 LOW_BAT.A PG.A STAT2.A U204.A1(VOUT) U204.B1(VOUT) VREG.SEL.1
VSRC_SW [power]: C.PHAT.1 L1.2 S201.3(S) U204.A2(VIN) U204.B2(VIN)
VUSB_DIODE [power]: D2.C USB.VSRC.1
Unconnected: J1.6(SWO/TDO) J1.7(KEY) J1.8(NC/TDI) J1.9(GNDDTCT) J3.33 J3.35 J3.37 J3.39 J3.41 J3.43 J3.45 J3.46 J3.48 J3.50 J5.A2(_CONNECTOR:SSTXP1) J5.A3(_CONNECTOR:SSTXN1) J5.A10(_CONNECTOR:SSRXN2) J5.A11(_CONNECTOR:SSRXP2) J5.B2(_CONNECTOR:SSTXP2) J5.B3(_CONNECTOR:SSTXN2) J5.B10(_CONNECTOR:SSRXN1) J5.B11(_CONNECTOR:SSRXP1) S201.1(O) U13.5(NC) U13.7(PRTPWR1) U13.8(OCS_N1) U13.11(PRTPWR2) U13.12(OCS_N2)

### Buses
MAIN_DATA_SIGNALS:MAIN_GPIO0,MAIN_GPIO1,MAIN_GPIO2,MAIN_GPIO3,MAIN_GPIO4/SERCOM_P0,MAIN_GPIO5/SERCOM_P1,MAIN_GPIO6/SERCOM_P2,MAIN_GPIO7/SERCOM_P3,MAIN_GPIO8,MAIN_GPIO9,MAIN_GPIO10,MAIN_GPIO11,MAIN_TRACE_CLK/GPIO17,MAIN_TRACE_D0/GPIO13,MAIN_TRACE_D1/GPIO14,MAIN_TRACE_D2/GPIO15,MAIN_TRACE_D3/GPIO16,MAIN_TRACE_SWO/GPIO12,MAIN_USART_RX,MAIN_USART_TX,MAIN_USB_DATA_N,MAIN_USB_DATA_P
JTAG:INSTR_PROC_JTAG_TCK/SWCLK,INSTR_PROC_JTAG_TDI,INSTR_PROC_JTAG_TDO/SWO,INSTR_PROC_JTAG_TMS/SWDIO,INSTR_PROC_NRESET,MAIN_GPIO8,MAIN_GPIO9,MAIN_GPIO10,MAIN_GPIO11,MAIN_NRESET,MAIN_SWD_SWCLK,MAIN_SWD_SWDIO,MAIN_TRACE_CLK/GPIO17,MAIN_TRACE_D0/GPIO13,MAIN_TRACE_D1/GPIO14,MAIN_TRACE_D2/GPIO8,MAIN_TRACE_D2/GPIO15,MAIN_TRACE_D3/GPIO9,MAIN_TRACE_D3/GPIO16,MAIN_TRACE_SWO/GPIO12
POWER:3V3_INSTR_PROC,AGND,DGND,EXT_VIN,USB_VBUS,V_BATT_MAIN,VBUS,VCHRG_BATT,VDD_TO_MAIN,VSRC,VSRC_RAW
POWER_SENSING:CM_DIFFAMP_N4,CM_DIFFAMP_P4,CM_DTR0_DCBIAS_SHUTDOWN,CM_DTR0_DIFFAMP_GAIN0,CM_DTR0_DIFFAMP_GAIN1,CM_DTR0_DIFFAMP_N,CM_DTR0_DIFFAMP_OUT,CM_DTR0_DIFFAMP_P3,CM_DTR0_OPAMP_ENABLE,CM_DTR0_OPAMP_N,CM_DTR0_OPAMP_OUT,CM_DTR0_V_OFFSET_IN,CM_DTR0_V_SENSE_N,CM_DTR0_V_SENSE_P,CM_DTR1_DCBIAS_SHUTDOWN,CM_DTR1_DIFFAMP_GAIN0,CM_DTR1_DIFFAMP_GAIN1,CM_DTR1_DIFFAMP_N,CM_DTR1_DIFFAMP_OUT,CM_DTR1_DIFFAMP_P,CM_DTR1_OPAMP_N,CM_DTR1_OPAMP_OUT,CM_DTR1_OPAMP_P,CM_DTR1_V_OFFSET_IN,CM_DTR1_V_SENSE_N,CM_DTR1_V_SENSE_P,CM_DTR_OPAMP_ENABLE,CM_OPAMP_ENABLE4,CM_OPAMP_N4,CM_OPAMP_OUT4,CM_OPAMP_P1,CM_OPAMP_P3,CM_OPAMP_P4,CM_PROC_DCBIAS_SHUTDOWN,CM_PROC_DIFFAMP_GAIN0,CM_PROC_DIFFAMP_GAIN1,CM_PROC_DIFFAMP_OUT,CM_PROC_V_OFFSET_IN,CM_PROC_V_SENSE_N,CM_PROC_V_SENSE_P,CM_STOR_DCBIAS_SHUTDOWN,CM_STOR_DIFFAMP_GAIN0,CM_STOR_DIFFAMP_GAIN1,CM_STOR_DIFFAMP_N1,CM_STOR_DIFFAMP_OUT,CM_STOR_DIFFAMP_P1,CM_STOR_OPAMP_ENABLE,CM_STOR_OPAMP_N,CM_STOR_OPAMP_OUT,CM_STOR_V_OFFSET_IN,CM_STOR_V_SENSE_N,CM_STOR_V_SENSE_P,V_SENSE_P
USB:HUB_INSTR_PROC_USB_D_N,HUB_INSTR_PROC_USB_D_P,INSTR_PROC_USB_D_N,INSTR_PROC_USB_D_P,MAIN_USB_DATA_N,MAIN_USB_DATA_P,USB_BKUP_DBG_D_N,USB_BKUP_DBG_D_P,USB_BKUP_DBG_OTGID,USB_BKUP_DBG_VBUS,USB_BKUP_MAIN_D_N,USB_BKUP_MAIN_D_P,USB_BKUP_MAIN_OTGID,USB_BKUP_MAIN_VBUS,USBC_VBUS,USB_D_N,USB_D_P,USB_VBUS,VBUS

### Notes on the sheet
- Extra Power Source (Solar)
- ESD protection
- USB Type-C Connector
- Power switch
- GND Bridge
- All analog signals should be
  routed between the GND domains
  underneath this resistor
- 5x2 0.05'' JTAG connector (Main)
- pullups are present on main board
- USB Hub/Switch
- Floating bc 
  internal pull-ups
- Red
- Debug to Main
  board connector
- Mark port 2 
    as removeable
- Green
- Regulators
- Battery Charger | Yellow | Green
- Orange
- Trace signals may be reused as GPIOs; 
  they require a special debugger, 
  but allow in-depth debugging
- GPIO Expansion
    for main board

## Sheet 3 of 3
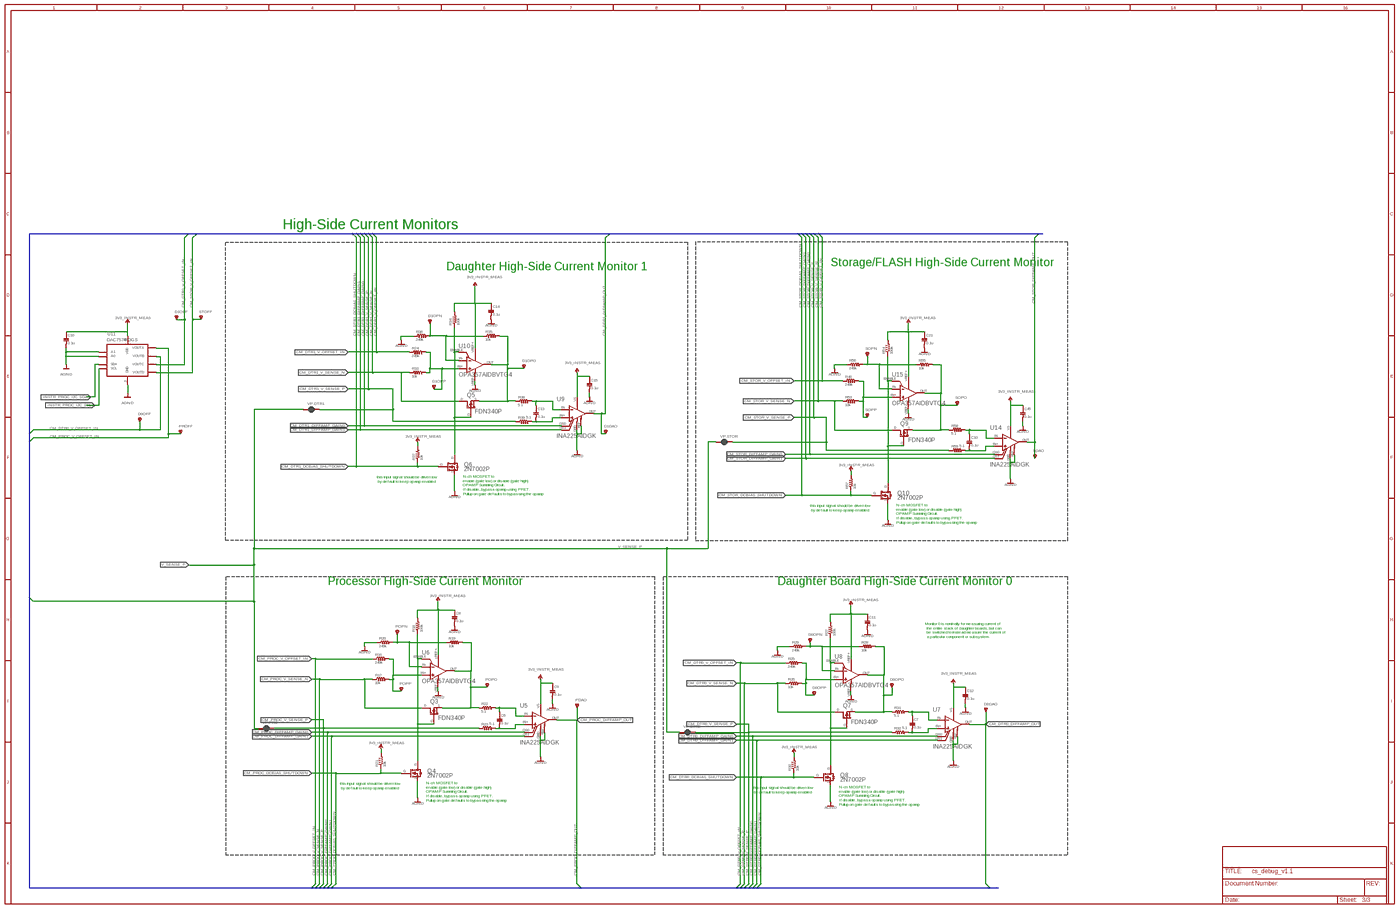
[diagram p5: schematic, sheet 3, overview]
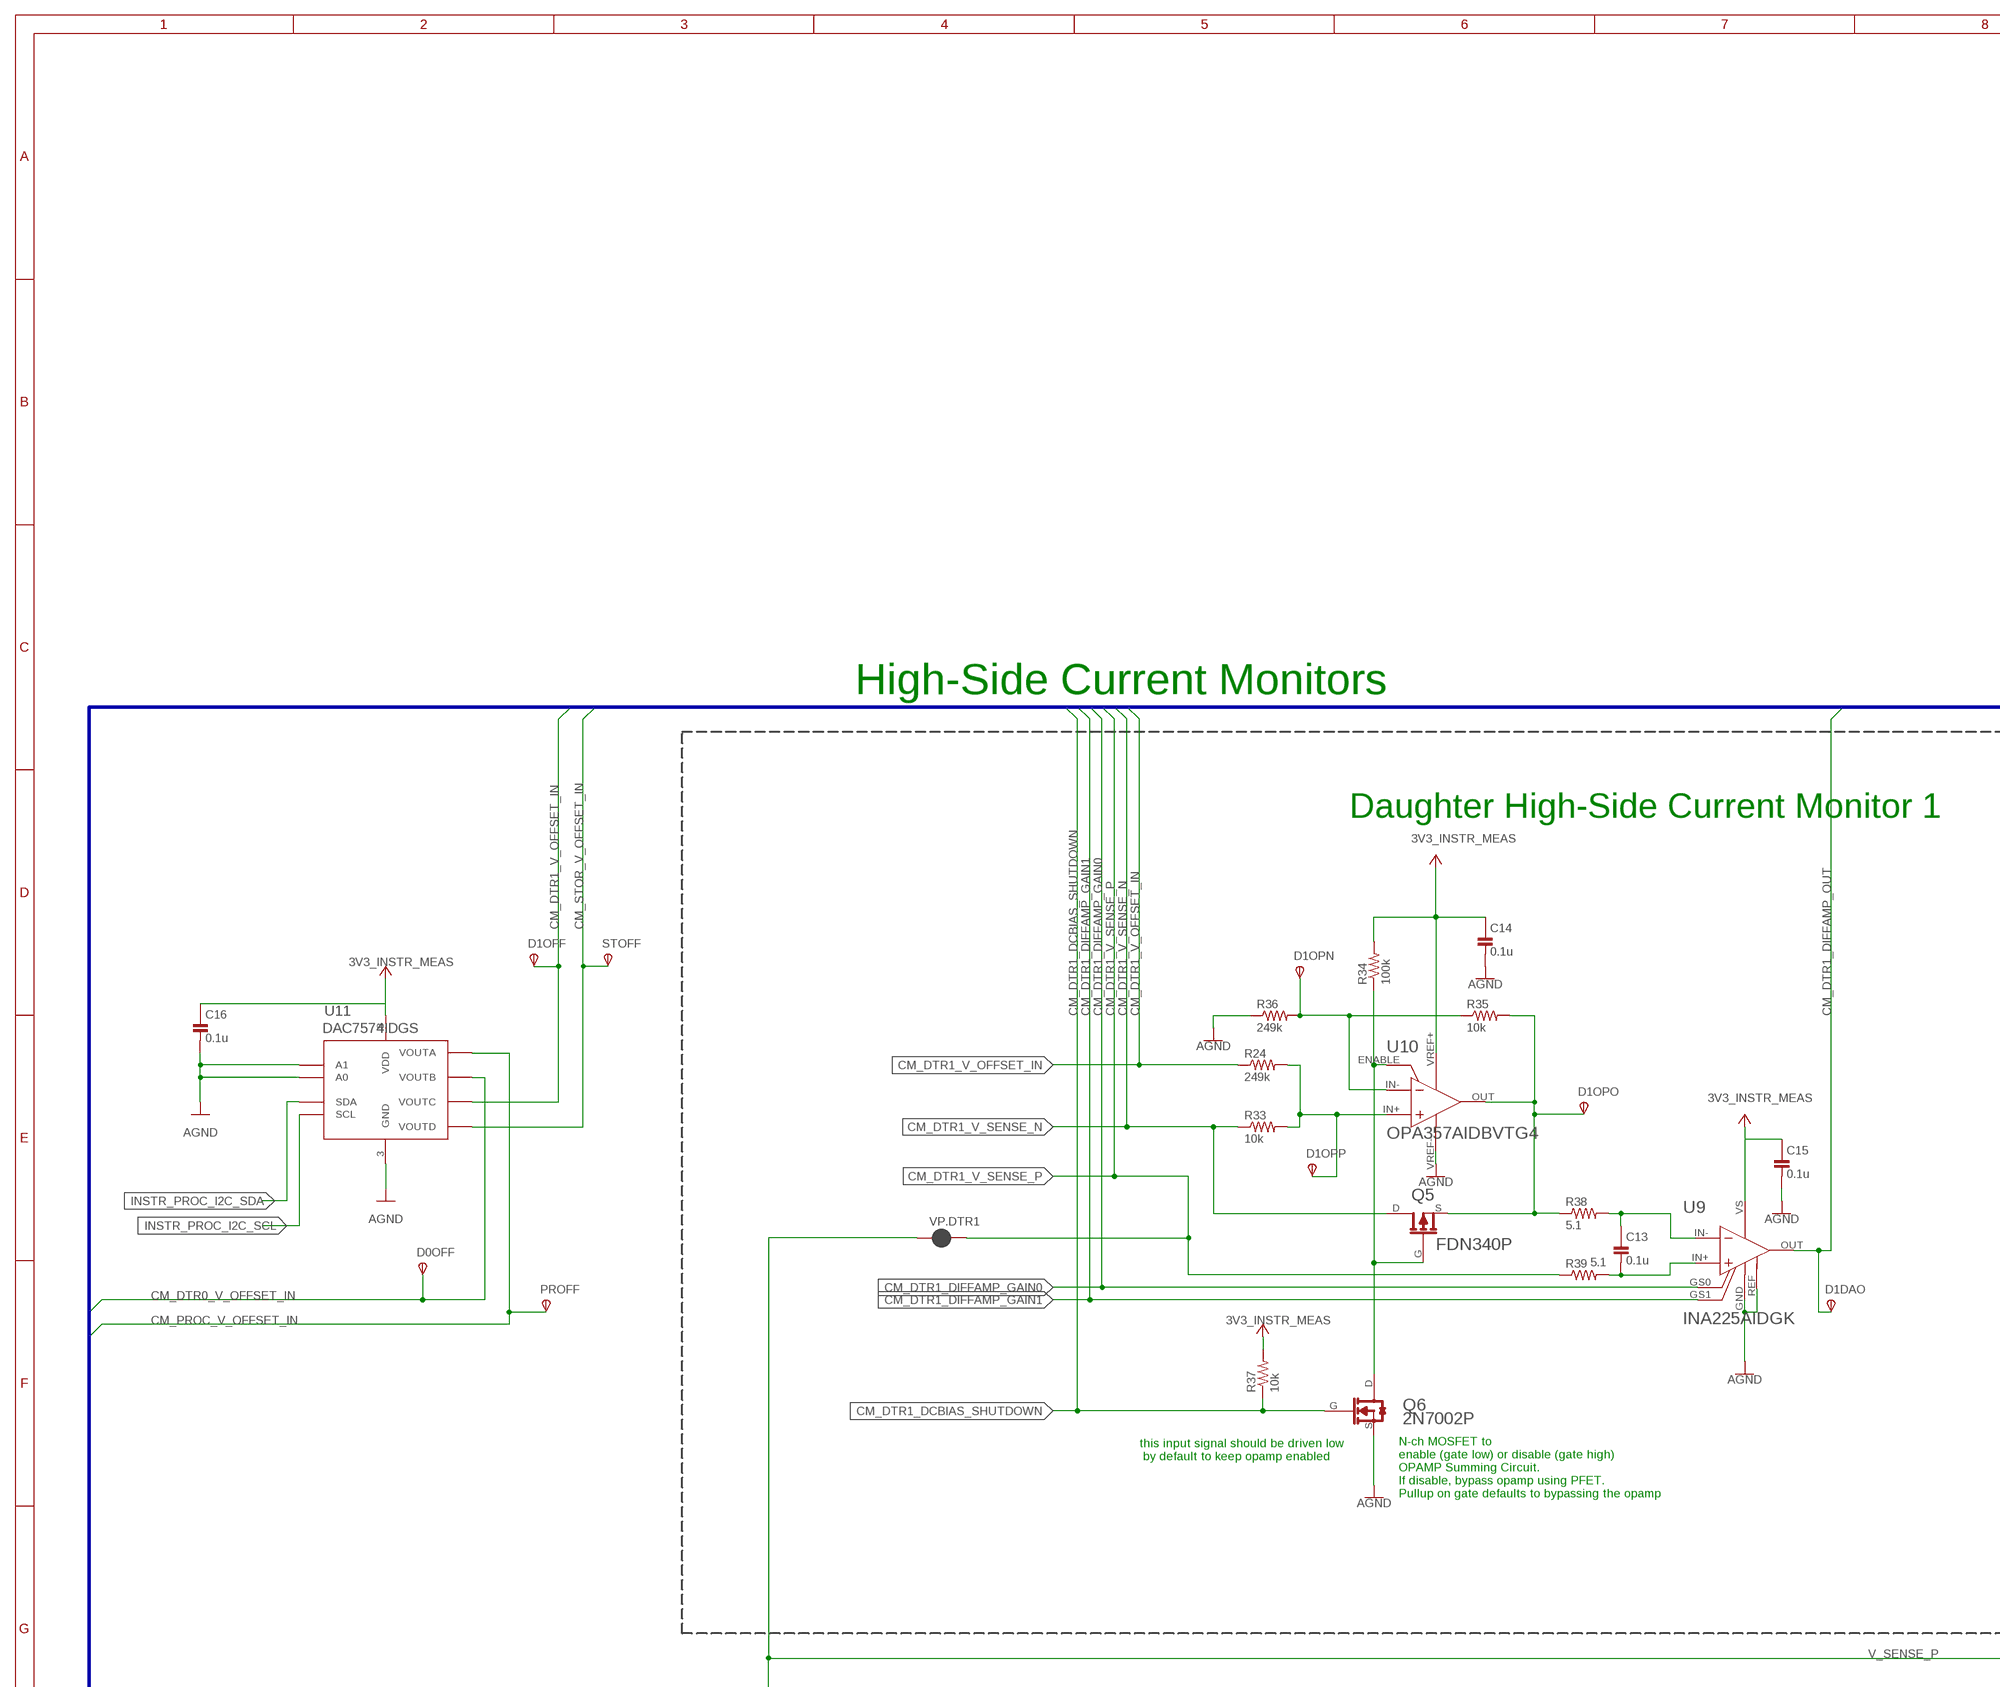
[diagram p6: schematic, sheet 3, part 1 of 4]
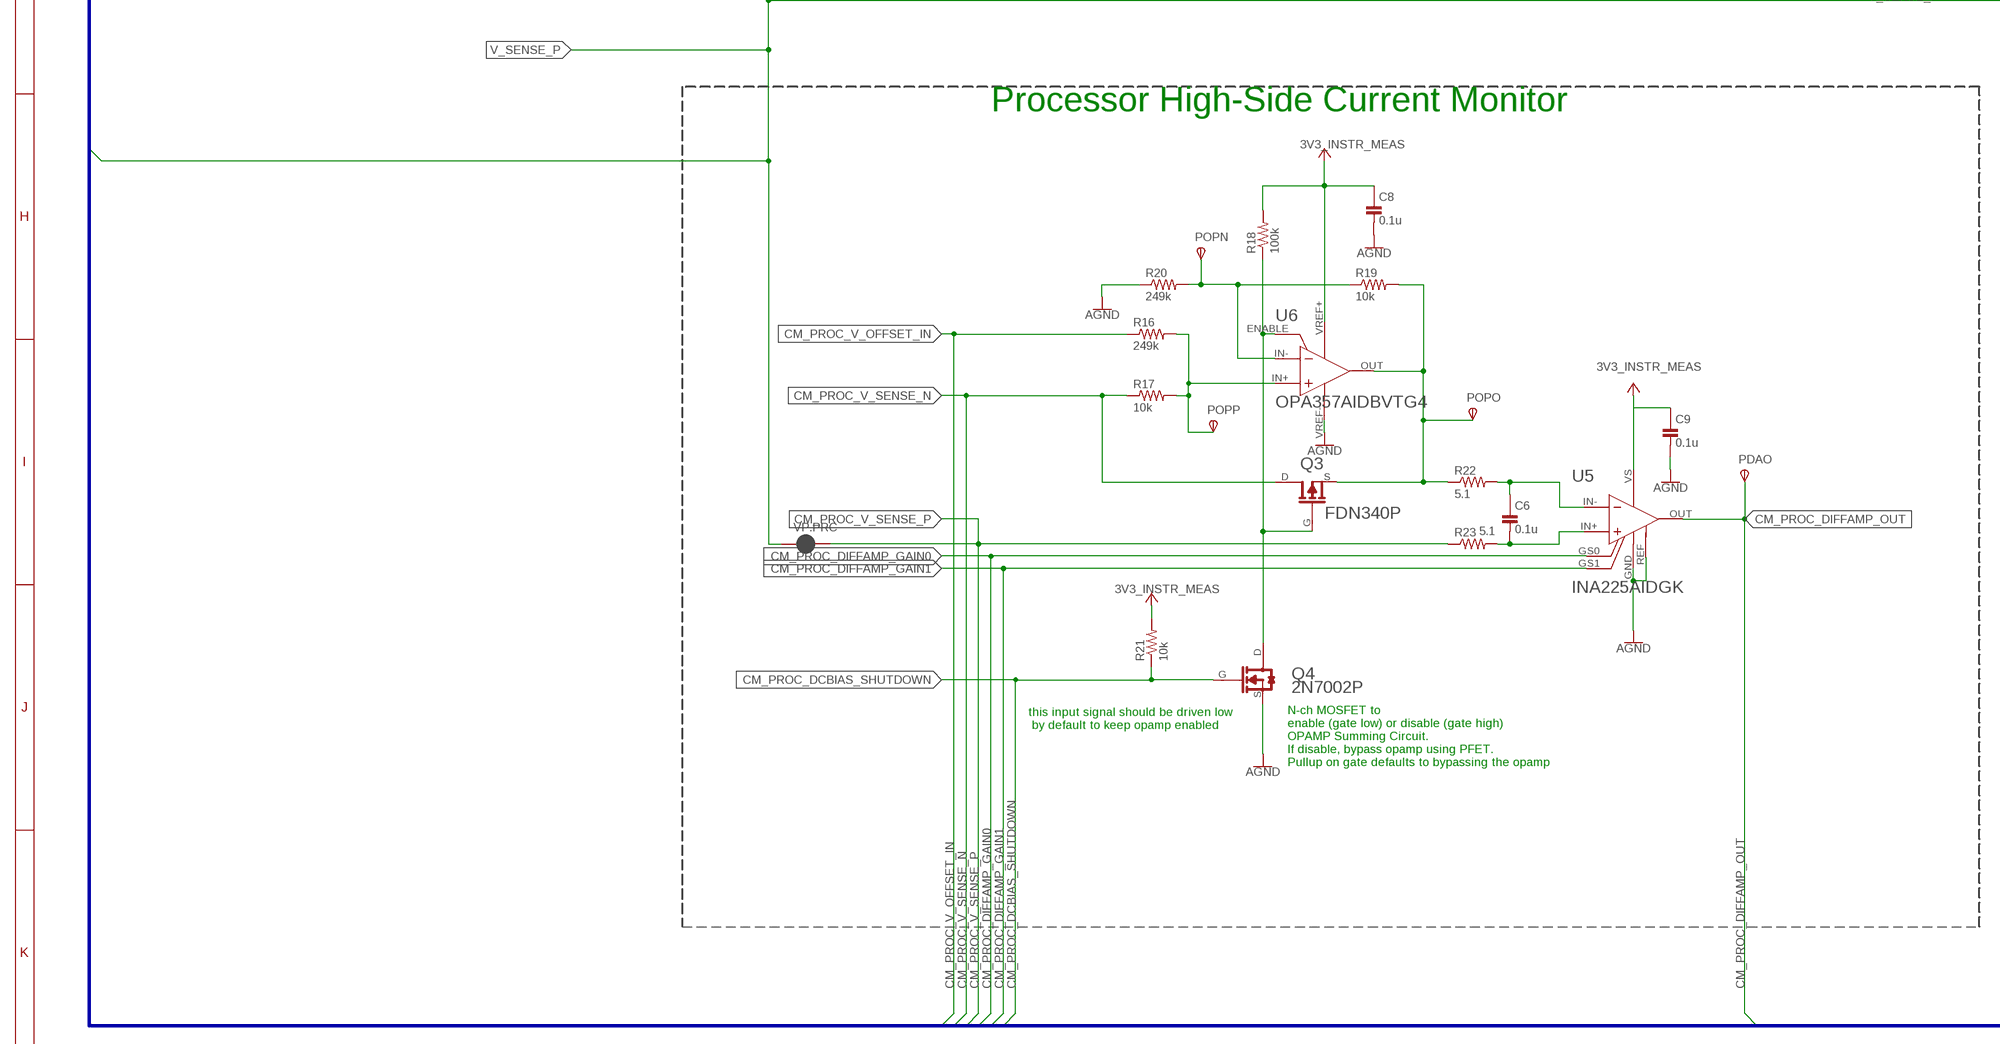
[diagram p7: schematic, sheet 3, part 2 of 4]
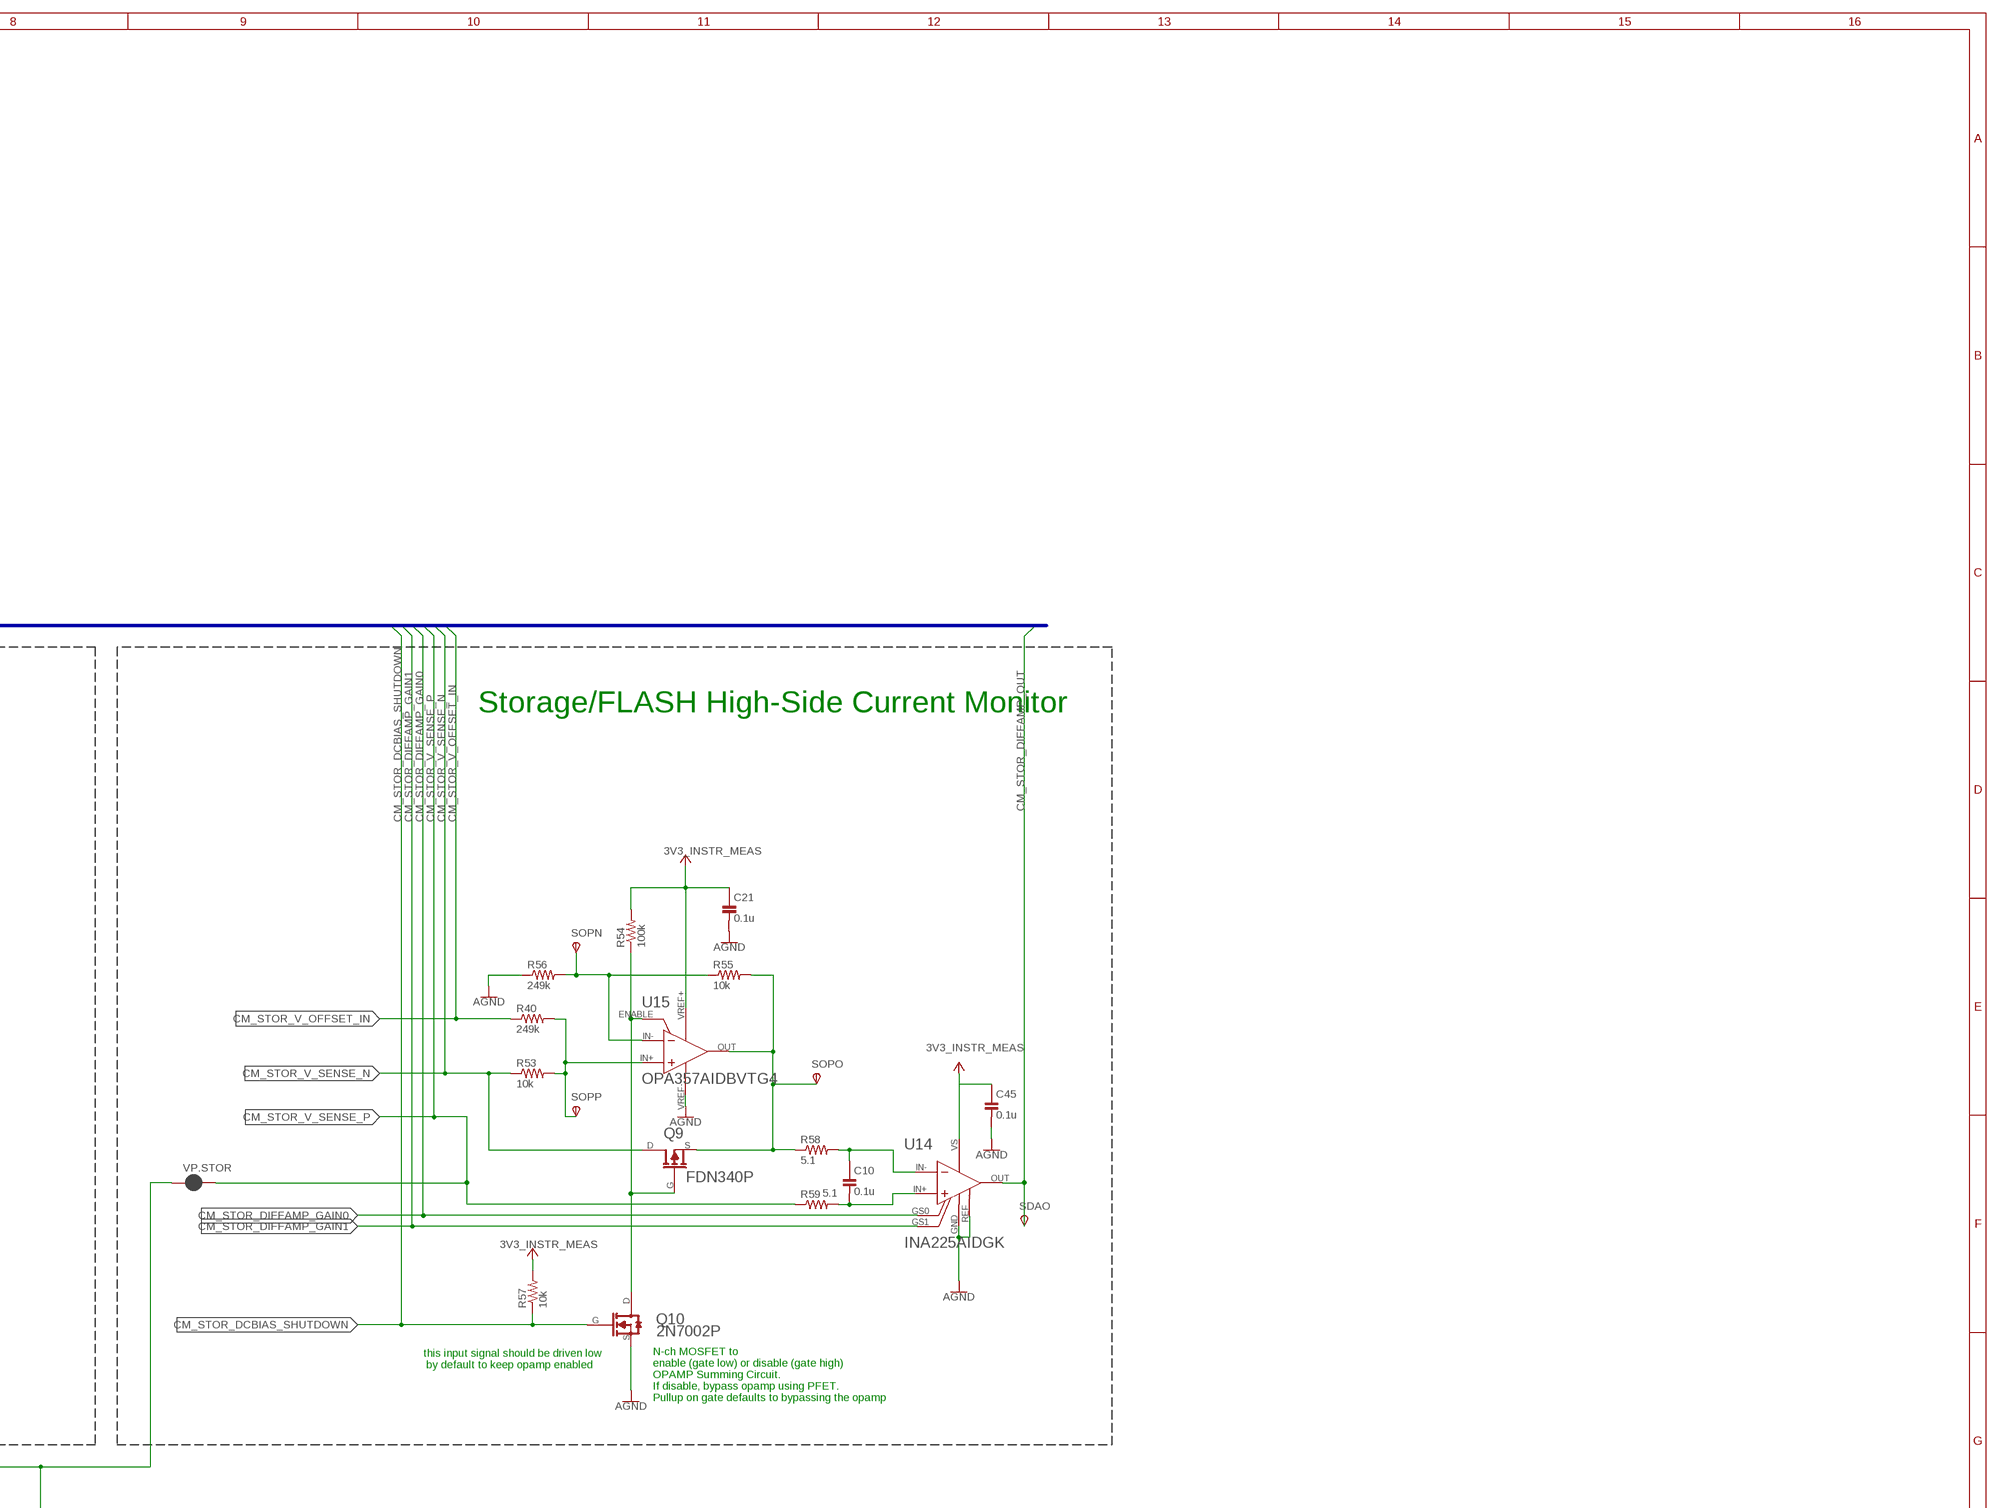
[diagram p8: schematic, sheet 3, part 3 of 4]
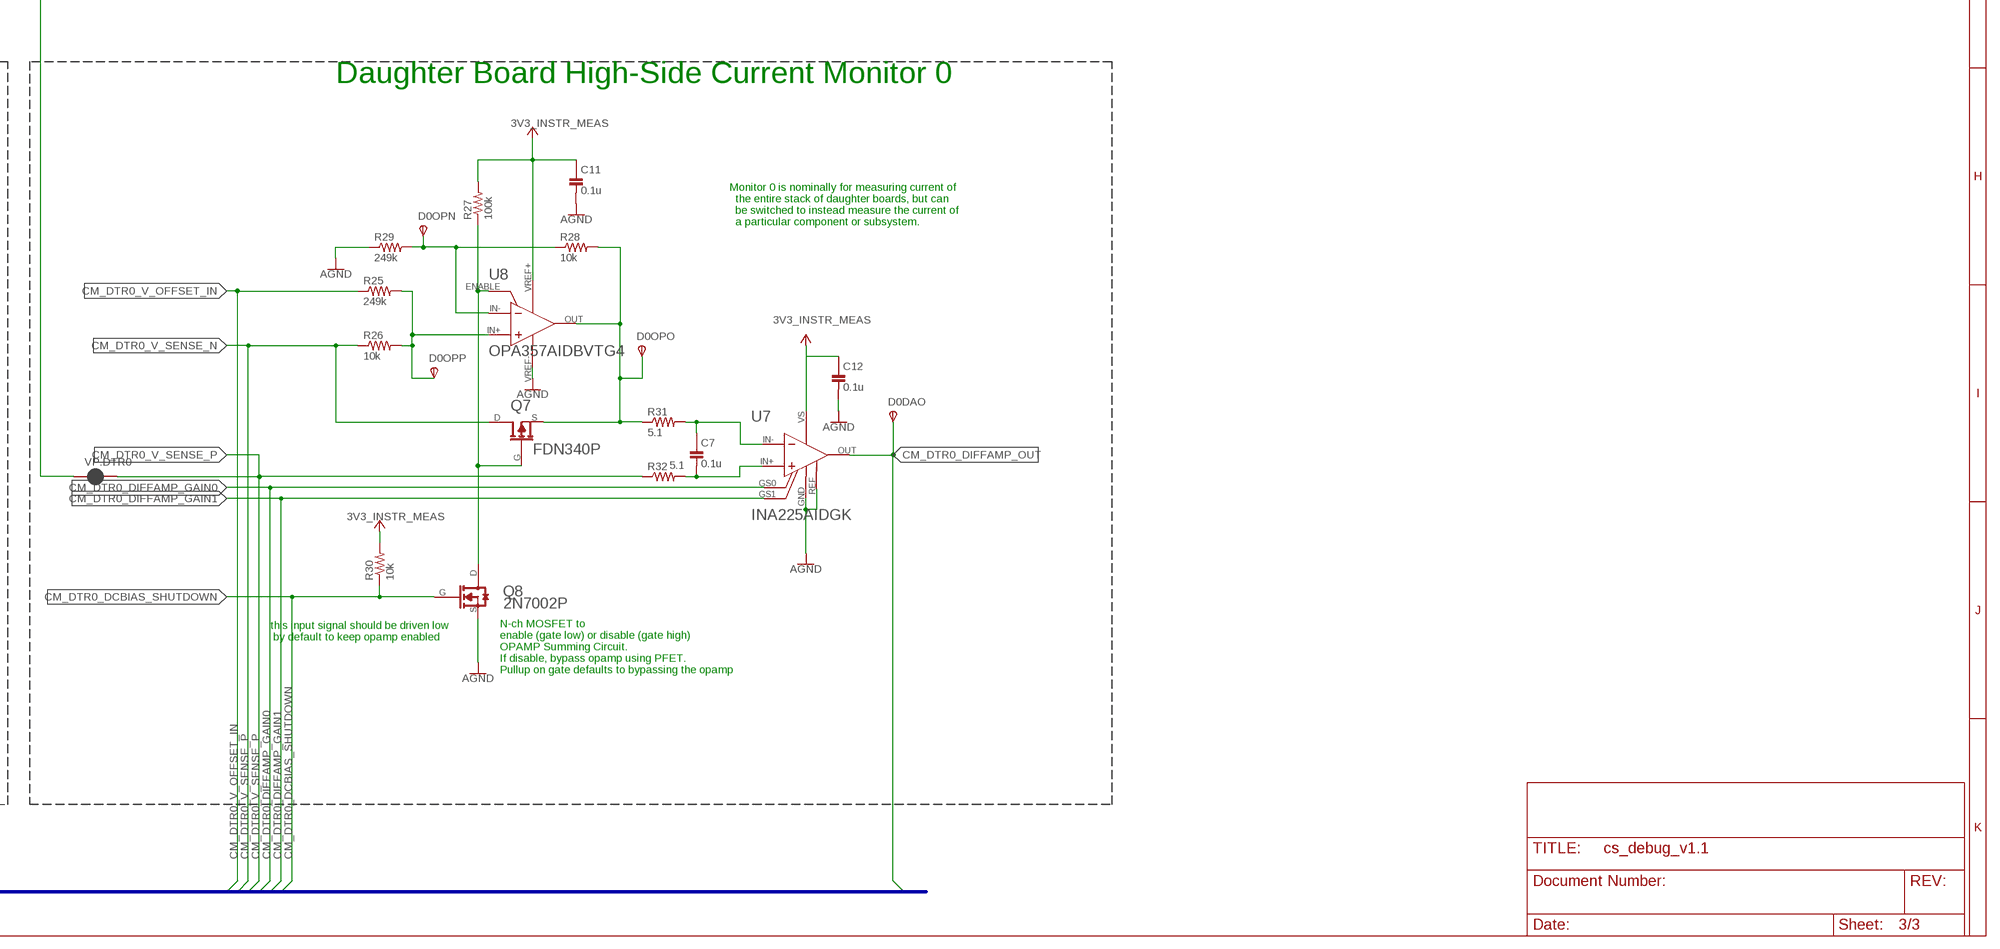
[diagram p9: schematic, sheet 3, part 4 of 4]

### Parts
C6  0.1u  C-0402  [C0402]
C7  0.1u  C-0402  [C0402]
C8  0.1u  C-0402  [C0402]
C9  0.1u  C-0402  [C0402]
C10  0.1u  C-0402  [C0402]
C11  0.1u  C-0402  [C0402]
C12  0.1u  C-0402  [C0402]
C13  0.1u  C-0402  [C0402]
C14  0.1u  C-0402  [C0402]
C15  0.1u  C-0402  [C0402]
C16  0.1u  C-0402  [C0402]
C21  0.1u  C-0402  [C0402]
C45  0.1u  C-0402  [C0402]
D0DAO  TPSTP10SQ  [TP10SQ]
D0OFF  TPSTP10SQ  [TP10SQ]
D0OPN  TPSTP10SQ  [TP10SQ]
D0OPO  TPSTP10SQ  [TP10SQ]
D0OPP  TPSTP10SQ  [TP10SQ]
D1DAO  TPSTP10SQ  [TP10SQ]
D1OFF  TPSTP10SQ  [TP10SQ]
D1OPN  TPSTP10SQ  [TP10SQ]
D1OPO  TPSTP10SQ  [TP10SQ]
D1OPP  TPSTP10SQ  [TP10SQ]
PDAO  TPSTP10SQ  [TP10SQ]
POPN  TPSTP10SQ  [TP10SQ]
POPO  TPSTP10SQ  [TP10SQ]
POPP  TPSTP10SQ  [TP10SQ]
PROFF  TPSTP10SQ  [TP10SQ]
Q3  FDN340P  [SOT23-3_FDN340P]
Q4  2N7002P  [SOT23-3_2N7002P]
Q5  FDN340P  [SOT23-3_FDN340P]
Q6  2N7002P  [SOT23-3_2N7002P]
Q7  FDN340P  [SOT23-3_FDN340P]
Q8  2N7002P  [SOT23-3_2N7002P]
Q9  FDN340P  [SOT23-3_FDN340P]
Q10  2N7002P  [SOT23-3_2N7002P]
R16  249k  R-0402  [R0402]
R17  10k  R-0402  [R0402]
R18  100k  R-0402  [R0402]
R19  10k  R-0402  [R0402]
R20  249k  R-0402  [R0402]
R21  10k  R-0402  [R0402]
R22  5.1  R-0603  [R0603]
R23  5.1  R-0603  [R0603]
R24  249k  R-0402  [R0402]
R25  249k  R-0402  [R0402]
R26  10k  R-0402  [R0402]
R27  100k  R-0402  [R0402]
R28  10k  R-0402  [R0402]
R29  249k  R-0402  [R0402]
R30  10k  R-0402  [R0402]
R31  5.1  R-0603  [R0603]
R32  5.1  R-0603  [R0603]
R33  10k  R-0402  [R0402]
R34  100k  R-0402  [R0402]
R35  10k  R-0402  [R0402]
R36  249k  R-0402  [R0402]
R37  10k  R-0402  [R0402]
R38  5.1  R-0603  [R0603]
R39  5.1  R-0603  [R0603]
R40  249k  R-0402  [R0402]
R53  10k  R-0402  [R0402]
R54  100k  R-0402  [R0402]
R55  10k  R-0402  [R0402]
R56  249k  R-0402  [R0402]
R57  10k  R-0402  [R0402]
R58  5.1  R-0603  [R0603]
R59  5.1  R-0603  [R0603]
SDAO  TPSTP10SQ  [TP10SQ]
SOPN  TPSTP10SQ  [TP10SQ]
SOPO  TPSTP10SQ  [TP10SQ]
SOPP  TPSTP10SQ  [TP10SQ]
STOFF  TPSTP10SQ  [TP10SQ]
U5  INA225AIDGK  [DGK-MSOP8_INA225]
U6  OPA357AIDBVTG4  [OPA357AIDBVTG4]
U7  INA225AIDGK  [DGK-MSOP8_INA225]
U8  OPA357AIDBVTG4  [OPA357AIDBVTG4]
U9  INA225AIDGK  [DGK-MSOP8_INA225]
U10  OPA357AIDBVTG4  [OPA357AIDBVTG4]
U11  DAC7574IDGS  [DGS10]
U14  INA225AIDGK  [DGK-MSOP8_INA225]
U15  OPA357AIDBVTG4  [OPA357AIDBVTG4]
VP.DTR0  JUMPER-SMT_2_NC_PASTE_NO-SILK  [SMT-JUMPER_2_NC_PASTE_NO-SILK]
VP.DTR1  JUMPER-SMT_2_NC_PASTE_NO-SILK  [SMT-JUMPER_2_NC_PASTE_NO-SILK]
VP.PRC  JUMPER-SMT_2_NC_PASTE_NO-SILK  [SMT-JUMPER_2_NC_PASTE_NO-SILK]
VP.STOR  JUMPER-SMT_2_NC_PASTE_NO-SILK  [SMT-JUMPER_2_NC_PASTE_NO-SILK]

### Nets
3V3_INSTR_MEAS [power]: C8.1 C9.1 C11.1 C12.1 C14.1 C15.1 C16.1 C21.1 C45.1 R18.2 R21.2 R27.2 R30.2 R34.2 R37.2 R54.2 R57.2 U5.VS(V+) U6.VREF+(V+) U7.VS(V+) U8.VREF+(V+) U9.VS(V+) U10.VREF+(V+) U11.8(VDD) U14.VS(V+) U15.VREF+(V+) ; supply symbol labelled +3V3 ; also sheet 2
AGND [GND]: C8.2 C9.2 C11.2 C12.2 C14.2 C15.2 C16.2 C21.2 C45.2 Q4.S(SOURCE) Q6.S(SOURCE) Q8.S(SOURCE) Q10.S(SOURCE) R20.1 R29.1 R36.1 R56.1 U5.GND(V-) U5.REF U6.VREF-(V-) U7.GND(V-) U7.REF U8.VREF-(V-) U9.GND(V-) U9.REF U10.VREF-(V-) U11.3(GND) U11.9(A0) U11.10(A1) U14.GND(V-) U14.REF U15.VREF-(V-) ; also sheet 2
CM_DIFFAMP_N4: C6.1 R22.2 U5.IN-
CM_DIFFAMP_P4: C6.2 R23.2 U5.IN+
CM_DTR0_DCBIAS_SHUTDOWN: Q8.G(GATE) R30.1 ; also sheet 1
CM_DTR0_DIFFAMP_GAIN0: U7.GS0 ; also sheet 1
CM_DTR0_DIFFAMP_GAIN1: U7.GS1 ; also sheet 1
CM_DTR0_DIFFAMP_N: C7.1 R31.2 U7.IN-
CM_DTR0_DIFFAMP_OUT: D0DAO.TP(PP) U7.OUT ; also sheet 1
CM_DTR0_DIFFAMP_P3: C7.2 R32.2 U7.IN+
CM_DTR0_OPAMP_ENABLE: Q7.G Q8.D(DRAIN) R27.1 U8.ENABLE
CM_DTR0_OPAMP_N: D0OPN.TP(PP) R28.1 R29.2 U8.IN-
CM_DTR0_OPAMP_OUT: D0OPO.TP(PP) Q7.S R28.2 R31.1 U8.OUT
CM_DTR0_V_OFFSET_IN: D0OFF.TP(PP) R25.1 U11.2(VOUTB)
CM_DTR0_V_SENSE_N: Q7.D R26.1 ; also sheet 2
CM_DTR0_V_SENSE_P: R32.1 VP.DTR0.2
CM_DTR1_DCBIAS_SHUTDOWN: Q6.G(GATE) R37.1 ; also sheet 1
CM_DTR1_DIFFAMP_GAIN0: U9.GS0 ; also sheet 1
CM_DTR1_DIFFAMP_GAIN1: U9.GS1 ; also sheet 1
CM_DTR1_DIFFAMP_N: C13.1 R38.2 U9.IN-
CM_DTR1_DIFFAMP_OUT: D1DAO.TP(PP) U9.OUT ; also sheet 1
CM_DTR1_DIFFAMP_P: C13.2 R39.2 U9.IN+
CM_DTR1_OPAMP_N: D1OPN.TP(PP) R35.1 R36.2 U10.IN-
CM_DTR1_OPAMP_OUT: D1OPO.TP(PP) Q5.S R35.2 R38.1 U10.OUT
CM_DTR1_OPAMP_P: D1OPP.TP(PP) R24.2 R33.2 U10.IN+
CM_DTR1_V_OFFSET_IN: D1OFF.TP(PP) R24.1 U11.4(VOUTC)
CM_DTR1_V_SENSE_N: Q5.D R33.1 ; also sheet 2
CM_DTR1_V_SENSE_P: R39.1 VP.DTR1.2
CM_DTR_OPAMP_ENABLE: Q5.G Q6.D(DRAIN) R34.1 U10.ENABLE
CM_OPAMP_ENABLE4: Q3.G Q4.D(DRAIN) R18.1 U6.ENABLE
CM_OPAMP_N4: POPN.TP(PP) R19.1 R20.2 U6.IN-
CM_OPAMP_OUT4: POPO.TP(PP) Q3.S R19.2 R22.1 U6.OUT
CM_OPAMP_P1: R40.2 R53.2 SOPP.TP(PP) U15.IN+
CM_OPAMP_P3: D0OPP.TP(PP) R25.2 R26.2 U8.IN+
CM_OPAMP_P4: POPP.TP(PP) R16.2 R17.2 U6.IN+
CM_PROC_DCBIAS_SHUTDOWN: Q4.G(GATE) R21.1 ; also sheet 1
CM_PROC_DIFFAMP_GAIN0: U5.GS0 ; also sheet 1
CM_PROC_DIFFAMP_GAIN1: U5.GS1 ; also sheet 1
CM_PROC_DIFFAMP_OUT: PDAO.TP(PP) U5.OUT ; also sheet 1
CM_PROC_V_OFFSET_IN: PROFF.TP(PP) R16.1 U11.1(VOUTA)
CM_PROC_V_SENSE_N: Q3.D R17.1 ; also sheet 2
CM_PROC_V_SENSE_P: R23.1 VP.PRC.2
CM_STOR_DCBIAS_SHUTDOWN: Q10.G(GATE) R57.1 ; also sheet 1
CM_STOR_DIFFAMP_GAIN0: U14.GS0 ; also sheet 1
CM_STOR_DIFFAMP_GAIN1: U14.GS1 ; also sheet 1
CM_STOR_DIFFAMP_N1: C10.1 R58.2 U14.IN-
CM_STOR_DIFFAMP_OUT: SDAO.TP(PP) U14.OUT ; also sheet 1
CM_STOR_DIFFAMP_P1: C10.2 R59.2 U14.IN+
CM_STOR_OPAMP_ENABLE: Q9.G Q10.D(DRAIN) R54.1 U15.ENABLE
CM_STOR_OPAMP_N: R55.1 R56.2 SOPN.TP(PP) U15.IN-
CM_STOR_OPAMP_OUT: Q9.S R55.2 R58.1 SOPO.TP(PP) U15.OUT
CM_STOR_V_OFFSET_IN: R40.1 STOFF.TP(PP) U11.5(VOUTD)
CM_STOR_V_SENSE_N: Q9.D R53.1 ; also sheet 2
CM_STOR_V_SENSE_P: R59.1 VP.STOR.2
INSTR_PROC_I2C_SCL: U11.6(SCL) ; also sheet 1
INSTR_PROC_I2C_SDA: U11.7(SDA) ; also sheet 1
V_SENSE_P: VP.DTR0.1 VP.DTR1.1 VP.PRC.1 VP.STOR.1 ; also sheet 2

### Buses
POWER_SENSING:CM_DIFFAMP_N4,CM_DIFFAMP_P4,CM_DTR0_DCBIAS_SHUTDOWN,CM_DTR0_DIFFAMP_GAIN0,CM_DTR0_DIFFAMP_GAIN1,CM_DTR0_DIFFAMP_N,CM_DTR0_DIFFAMP_OUT,CM_DTR0_DIFFAMP_P3,CM_DTR0_OPAMP_ENABLE,CM_DTR0_OPAMP_N,CM_DTR0_OPAMP_OUT,CM_DTR0_V_OFFSET_IN,CM_DTR0_V_SENSE_N,CM_DTR0_V_SENSE_P,CM_DTR1_DCBIAS_SHUTDOWN,CM_DTR1_DIFFAMP_GAIN0,CM_DTR1_DIFFAMP_GAIN1,CM_DTR1_DIFFAMP_N,CM_DTR1_DIFFAMP_OUT,CM_DTR1_DIFFAMP_P,CM_DTR1_OPAMP_N,CM_DTR1_OPAMP_OUT,CM_DTR1_OPAMP_P,CM_DTR1_V_OFFSET_IN,CM_DTR1_V_SENSE_N,CM_DTR1_V_SENSE_P,CM_DTR_OPAMP_ENABLE,CM_OPAMP_ENABLE4,CM_OPAMP_N4,CM_OPAMP_OUT4,CM_OPAMP_P1,CM_OPAMP_P3,CM_OPAMP_P4,CM_PROC_DCBIAS_SHUTDOWN,CM_PROC_DIFFAMP_GAIN0,CM_PROC_DIFFAMP_GAIN1,CM_PROC_DIFFAMP_OUT,CM_PROC_V_OFFSET_IN,CM_PROC_V_SENSE_N,CM_PROC_V_SENSE_P,CM_STOR_DCBIAS_SHUTDOWN,CM_STOR_DIFFAMP_GAIN0,CM_STOR_DIFFAMP_GAIN1,CM_STOR_DIFFAMP_N1,CM_STOR_DIFFAMP_OUT,CM_STOR_DIFFAMP_P1,CM_STOR_OPAMP_ENABLE,CM_STOR_OPAMP_N,CM_STOR_OPAMP_OUT,CM_STOR_V_OFFSET_IN,CM_STOR_V_SENSE_N,CM_STOR_V_SENSE_P,V_SENSE_P

### Notes on the sheet
- High-Side Current Monitors
- Storage/FLASH High-Side Current Monitor
- Daughter High-Side Current Monitor 1
- this input signal should be driven low
   by default to keep opamp enabled
- N-ch MOSFET to 
  enable (gate low) or disable (gate high)
  OPAMP Summing Circuit.
  If disable, bypass opamp using PFET.
  Pullup on gate defaults to bypassing the opamp
- this input signal should be driven low
   by default to keep opamp enabled
- N-ch MOSFET to 
  enable (gate low) or disable (gate high)
  OPAMP Summing Circuit.
  If disable, bypass opamp using PFET.
  Pullup on gate defaults to bypassing the opamp
- Processor High-Side Current Monitor | Daughter Board High-Side Current Monitor 0
- Monitor 0 is nominally for measuring current of 
    the entire stack of daughter boards, but can 
    be switched to instead measure the current of
    a particular component or subsystem.
- this input signal should be driven low
   by default to keep opamp enabled
- this input signal should be driven low
   by default to keep opamp enabled
- N-ch MOSFET to 
  enable (gate low) or disable (gate high)
  OPAMP Summing Circuit.
  If disable, bypass opamp using PFET.
  Pullup on gate defaults to bypassing the opamp
- N-ch MOSFET to 
  enable (gate low) or disable (gate high)
  OPAMP Summing Circuit.
  If disable, bypass opamp using PFET.
  Pullup on gate defaults to bypassing the opamp

## Library data of the parts
3V3.MEAS IP.3V3 SCL SDA = TestPoints:TP: Test pad
C1 C2 = Capacitors:C-: Capacitor, Surface Mount; MANUFACTURER: Kemet; MPN: C0805C106M8RACTU; PART_NO: C0805C106M8RACTU; TC: X7R; TOL: 10%; VOLTAGE: 10V
C3-C5 C8 C9 C11 C12 C14-C16 C21 C22 C29-C45 C48-C53 = Capacitors:C-: Capacitor, Surface Mount; MANUFACTURER: Kemet; MPN: C0402C104K8RACTU; PART_NO: C0402C104K8RACTU; TC: X7R; TOL: 10%; VOLTAGE: 10V
C6 C7 C10 C13 = Capacitors:C-: Capacitor, Surface Mount; MANUFACTURER: Kemet; MPN: C0402C104K4RAC7411; PART_NO: C0402C104K4RAC7411; TC: X7R; TOL: 0.5pF; VOLTAGE: 10V
C17 C19 C103 C107 = Capacitors:C-: Capacitor, Surface Mount; MANUFACTURER: Kemet; MPN: C0603C160J5GACTU; PART_NO: C0603C160J5GACTU; TC: X7R; TOL: 10%; VOLTAGE: 6.3V
C18 C54 C208 = Capacitors:C-: Capacitor, Surface Mount; MANUFACTURER: Kemet; MPN: C0603C475M8PACTU; PART_NO: C0603C475M8PACTU; TC: X5R; TOL: 10%; VOLTAGE: 6.3V
C23-C27 C205 = Capacitors:C-: Capacitor, Surface Mount; MANUFACTURER: Kemet; MPN: C0805C226M8PAC7800; PART_NO: C0805C226M8PAC7800; TC: X5R; TOL: 10%; VOLTAGE: 10V
C28 = Capacitors:C-: Capacitor, Surface Mount; MANUFACTURER: Kemet; MPN: C0402C103K8RACTU; PART_NO: C0402C103K8RACTU; TC: X7R; TOL: 10%; VOLTAGE: 6.3V
C46 = Capacitors:C-: Capacitor, Surface Mount; MANUFACTURER: Kemet; MPN: C0603C225K8RACTU; PART_NO: C0603C225K8RACTU; TC: X7R; TOL: 10%; VOLTAGE: 6.3V
C47 = Capacitors:C-: Capacitor, Surface Mount; MANUFACTURER: Kemet; MPN: C0402C105K8PACTU; PART_NO: C0402C105K8PACTU; TC: X7R; TOL: 10%; VOLTAGE: 10V
C55 C56 = Capacitors:C-: Capacitor, Surface Mount; MANUFACTURER: Kemet; MPN: C0402C180J8GAC7867; PART_NO: C0402C180J8GAC7867; TC: X7R; TOL: 10%; VOLTAGE: 6.3V
C57 = Capacitors:C-: Capacitor, Surface Mount; MANUFACTURER: Kemet; PART_NO: C0402C105M8PACTU; TC: X5R; TOL: 10%; VOLTAGE: 10V
C108 = Capacitors:C-: Capacitor, Surface Mount; MANUFACTURER: Kemet; MPN: C0603C100K8RAC7867; PART_NO: C0603C100K8RAC7867; TC: X7R; TOL: 10%; VOLTAGE: 6.3V
C.PHAT = Capacitors:C-: Capacitor, Surface Mount; MANUFACTURER: Kemet; MPN: C1206C476M8PACTU; PART_NO: C1206C476M8PACTU; TC: X5R; TOL: 20%; VOLTAGE: 10V
CHRG EXT.SRC HUB.VDD IP.ANA IP.AREF IP.OUT IP.PLL IP.UTMI IP.VDDIO MN.CHRG MN.UART.RX MN.UART.TX MN.VDD REGMEAS REGPROC USB.VSRC VP.DTR0 VP.DTR1 VP.PRC VP.STOR = Connectors:JUMPER-SMT_2_NC_PASTE: Normally closed solder jumper This jumper has an aperture in the stencil to allow solder paste to bridge the split in the wire so it's normally closed (NC). Wick off the solder to open the connection. Reapply solder to reclose the connection.; BOM: EXCLUDE
D0DAO D0OFF D0OPN D0OPO D0OPP D1DAO D1OFF D1OPN D1OPO D1OPP PDAO POPN POPO POPP PROFF SDAO SOPN SOPO SOPP STOFF = TestPoints:TPS: TEST PIN
D1 D2 = adafruit:DIODE: Diode SMADIODE - SMA Surface Mount Package 20V 1A Schottky Diode Digikey: 641-1014-6-ND DO-1N4148 - Through Hole Small Current Diode SOD-123 20V 1 A (.5mV Vf) Schottky Diode - Digikey: MBRX120TPMSCT-ND SOD-323 10V 570mA (.38mV Vf, 3ns) Schottky Diode - Digikey: ZLLS410CT-ND SOD-523 30V 30mA Schottky Diode (RB751S-40TE61) - Digikey: RB751S-40TE61CT-ND SOT23-R/W - SOT23 Package (R = Solder Paste/Reflow Ovens, W = Hand-Soldering) BAT54Film 40V 300mA - Digikey: 497-7162-1-ND; MPN: MBR120VLSFT3G; PART_NO: MBR120VLSFT3G
F2 = adafruit:PTCFUSE: PTC fuses, resettable thermistors; MPN: MF-MSMF050-2; PART_NO: MF-MSMF050-2
HUB.HS PG = Diodes:LED: LED OSRAM: - CHIPLED LG R971, LG N971, LY N971, LG Q971, LY Q971, LO R971, LY R971 LH N974, LH R974 LS Q976, LO Q976, LY Q976 LO Q996 - Hyper CHIPLED LW Q18S LB Q993, LB Q99A, LB R99A - SideLED LS A670, LO A670, LY A670, LG A670, LP A670 LB A673, LV A673, LT A673, LW A673 LH A674 LY A675 LS A676, LA A676, LO A676, LY A676, LW A676 LS A679, LY A679, LG A679 - Hyper Micro SIDELED® LS Y876, LA Y876, LO Y876, LY Y876 LT Y87S - SmartLED LW L88C, LW L88S LB L89C, LB L89S, LG L890 LS L89K, LO L89K, LY L89K LS L896, LA L896, LO L896, LY L896 - TOPLED LS T670, LO T670, LY T670, LG T670, LP T670 LSG T670, LSP T670, LSY T670, LOP T670, LYG T670 LG T671, LOG T671, LSG T671 LB T673, LV T673, LT T673, LW T673 LH T674 LS T676, LA T676, LO T676, LY T676, LB T676, LH T676, LSB T676, LW T676 LB T67C, LV T67C, LT T67C, LS T67K, LO T67K, LY T67K, LW E67C LS E67B, LA E67B, LO E67B, LY E67B, LB E67C, LV E67C, LT E67C LW T67C LS T679, LY T679, LG T679 LS T770, LO T770, LY T770, LG T770, LP T770 LB T773, LV T773, LT T773, LW T773 LH T774 LS E675, LA E675, LY E675, LS T675 LS T776, LA T776, LO T776, LY T776, LB T776 LHGB T686 LT T68C, LB T68C - Hyper Mini TOPLED® LB M676 - Mini TOPLED Santana® LG M470 LS M47K, LO M47K, LY M47K Source: http://www.osram.convergy.de/; COLOR: Green; MP: LT Q39G-Q1OO-25-1; MPN: LT Q39G-Q1OO-25-1; PART_NO: LT Q39G-Q1OO-25-1
HUB.SUSP = Diodes:LED: LED OSRAM: - CHIPLED LG R971, LG N971, LY N971, LG Q971, LY Q971, LO R971, LY R971 LH N974, LH R974 LS Q976, LO Q976, LY Q976 LO Q996 - Hyper CHIPLED LW Q18S LB Q993, LB Q99A, LB R99A - SideLED LS A670, LO A670, LY A670, LG A670, LP A670 LB A673, LV A673, LT A673, LW A673 LH A674 LY A675 LS A676, LA A676, LO A676, LY A676, LW A676 LS A679, LY A679, LG A679 - Hyper Micro SIDELED® LS Y876, LA Y876, LO Y876, LY Y876 LT Y87S - SmartLED LW L88C, LW L88S LB L89C, LB L89S, LG L890 LS L89K, LO L89K, LY L89K LS L896, LA L896, LO L896, LY L896 - TOPLED LS T670, LO T670, LY T670, LG T670, LP T670 LSG T670, LSP T670, LSY T670, LOP T670, LYG T670 LG T671, LOG T671, LSG T671 LB T673, LV T673, LT T673, LW T673 LH T674 LS T676, LA T676, LO T676, LY T676, LB T676, LH T676, LSB T676, LW T676 LB T67C, LV T67C, LT T67C, LS T67K, LO T67K, LY T67K, LW E67C LS E67B, LA E67B, LO E67B, LY E67B, LB E67C, LV E67C, LT E67C LW T67C LS T679, LY T679, LG T679 LS T770, LO T770, LY T770, LG T770, LP T770 LB T773, LV T773, LT T773, LW T773 LH T774 LS E675, LA E675, LY E675, LS T675 LS T776, LA T776, LO T776, LY T776, LB T776 LHGB T686 LT T68C, LB T68C - Hyper Mini TOPLED® LB M676 - Mini TOPLED Santana® LG M470 LS M47K, LO M47K, LY M47K Source: http://www.osram.convergy.de/; COLOR: Orange; MP: 150060RS75000; MPN: 150060RS75000; PART_NO: 150060RS75000
J1 = Connectors:J-JTAG-CORTEX: Cortex Debug Connector - 10 pin Supports JTAG debug, Serial Wire debug, and Serial Wire Viewer. PTH and SMD connector options available. General Connector Information <http://infocenter.arm.com/help/topic/com.arm.doc.faqs/attached/13634/cortex_debug_connectors.pdf> Products: PTH Connector <http://www.digikey.com/product-detail/en/cnc-tech/3220-10-0100-00/1175-1627-ND/3883661> -via Digi-Key SparkFun PSoc <https://www.sparkfun.com/products/13229> SparkFun T <https://www.sparkfun.com/products/13810>; MANUFACTURER: Samtech Inc.; MPN: FTSH-105-01-L-DV-K-TR; PART_NO: FTSH-105-01-L-DV-K-TR
J3 = Connectors:HIROSE-DF40_50-PIN_CONNECTORS: Hirose DF40 series 50-pin mezzanine type connectors at 0.4mm pitch. Specification and Variants: https://www.hirose.com/product/document?clcode=&productname=&series=DF40&documenttype=Catalog&lang=en&documentid=D31649_en; MP: DF40C-50DP-0.4V(51); MPN: DF40C-50DP-0.4V(51); PART_NO: DF40C-50DP-0.4V(51)
J5 = Connectors:J-WURTH-USBC: USB 3.1 Type C Receptacle SMT ConUSB31 632723X00011 Characteristics INSULATOR: LCP FLAMMABILITY RATING: UL94-V0 COLOR: BLACK CONTACT MATERIAL: BRASS CONTACT PLATING: GOLD OVERPd-Ni CONTACT AREA: 30μ’’ Pd-Ni+2μ’’ Gold QUALITY CLASS: 10 000 MATING CYCLES OPERATING TEMPERATURE:-25°C UP TO +105°C COMPLIANCE: LEAD FREE AND ROHS ELECTRICAL CURRENT RATING: 3 A MAX WORKING VOLTAGE: 5 VDC WITHSTANDING VOLTAGE: 100 VAC/MIN INSULATION RESISTANCE: >1000 MΩ CONTACT RESISTANCE: 30 mΩ MAX <http://katalog.we-online.de/media/images/v2/Family_632723300011.jpg> Details see: http://katalog.we-online.de/en/em/COM_3_1_THT_SMT_TYPE_C_RECEPTACLE_HORIZONTAL/632723100011 2015 (C) Wurth Elektronik; AVAILABILITY: Unavailable; DESCRIPTION: USB - C _Type - C_ USB 3.1 _USB 3.1 Gen 2, Superspeed+_ Receptacle Connector 24 Position Surface Mount, Right Angle; Through Hole; MF: Wurth Electronics; MPN: 632723100011; PACKAGE: None; PART_NO: 632723100011; PRICE: None
J19 = Connectors:J-JST2: JST 2-Pin Connector SMT-RA (S2B-PH-SM4) 4UConnector #17311 SMT (B2B-PH-SM4) THM-RA (S2B-PH) THM (B2B-PH) SMT-RA (SM02B-SRSS-TB) SH (1mm pitch) Connector; MANUFACTURER: JST Sales America Inc.; MPN: S2B-PH-SM4-TB(LF)(SN); PART_NO: S2B-PH-SM4-TB(LF)(SN)
J.FTDI = Connectors:J-SERIAL-PORT: Arduino-style serial port connector Mates with the corresponding FTDI USB Serial cable. The attribute "DESCRIPTION" can be set to a string that will show on the schematic and the silkscreen.; DESCRIPTION: Console; DIGIKEY: 2057-PH1-06-UA-ND; MANUFACTURER: Adam Tech; MPN: PH1-06-UA; PART_NO: PH1-06-UA
JP1 = Connectors:J-HEADER-1X12; MP: TSW-112-07-T-S; MPN: TSW-112-07-T-S; PART_NO: TSW-112-07-T-S
L1 = SparkFun-Coils:INDUCTOR: Inductors Resist changes in electrical current. Basically a coil of wire. SparkFun Products: SparkFun Load Cell Amplifier - HX711 <https://www.sparkfun.com/products/13879> IOIO-OTG - V2.2 <https://www.sparkfun.com/products/13613>; MP: MLZ2012A3R3WT000; MPN: MLZ2012A3R3WT000; PART_NO: MLZ2012A3R3WT000; PROD_ID: NDUC-13076
L101 L102 = Inductors:MH2029-300Y: Ferrite Bead; MANUFACTURER: Bourns; MPN: MH2029-300Y; PART_NO: MH2029-300Y
L103 L104 = Inductors:MH2029-300Y: Ferrite Bead; MANUFACTURER: Bourns; MPN: MH2029-300Y; PART_NO: MH2029-300Y; SPICEPREFIX: L
LOW_BAT = Diodes:LED: LED OSRAM: - CHIPLED LG R971, LG N971, LY N971, LG Q971, LY Q971, LO R971, LY R971 LH N974, LH R974 LS Q976, LO Q976, LY Q976 LO Q996 - Hyper CHIPLED LW Q18S LB Q993, LB Q99A, LB R99A - SideLED LS A670, LO A670, LY A670, LG A670, LP A670 LB A673, LV A673, LT A673, LW A673 LH A674 LY A675 LS A676, LA A676, LO A676, LY A676, LW A676 LS A679, LY A679, LG A679 - Hyper Micro SIDELED® LS Y876, LA Y876, LO Y876, LY Y876 LT Y87S - SmartLED LW L88C, LW L88S LB L89C, LB L89S, LG L890 LS L89K, LO L89K, LY L89K LS L896, LA L896, LO L896, LY L896 - TOPLED LS T670, LO T670, LY T670, LG T670, LP T670 LSG T670, LSP T670, LSY T670, LOP T670, LYG T670 LG T671, LOG T671, LSG T671 LB T673, LV T673, LT T673, LW T673 LH T674 LS T676, LA T676, LO T676, LY T676, LB T676, LH T676, LSB T676, LW T676 LB T67C, LV T67C, LT T67C, LS T67K, LO T67K, LY T67K, LW E67C LS E67B, LA E67B, LO E67B, LY E67B, LB E67C, LV E67C, LT E67C LW T67C LS T679, LY T679, LG T679 LS T770, LO T770, LY T770, LG T770, LP T770 LB T773, LV T773, LT T773, LW T773 LH T774 LS E675, LA E675, LY E675, LS T675 LS T776, LA T776, LO T776, LY T776, LB T776 LHGB T686 LT T68C, LB T68C - Hyper Mini TOPLED® LB M676 - Mini TOPLED Santana® LG M470 LS M47K, LO M47K, LY M47K Source: http://www.osram.convergy.de/; COLOR: Orange; MP: LO Q976-PS-25-0-20-R18; MPN: LO Q976-PS-25-0-20-R18; PART_NO: LO Q976-PS-25-0-20-R18
Q3 Q5 Q7 Q9 = Switches:FDN340P: ON Semi SINGLE P-CHANNEL, LOGIC LEVEL, POWERTRENCH MOSFET; CENTROID_NOT_SPECIFIED: No; DATASHEET: https://www.fairchildsemi.com/datasheets/FD/FDN340P.pdf; DIGIKEY_DESCRIPTION: TRANS MOSFET P-CH 20V 2A SSOT3; DIGIKEY_PART_NUMBER: FDN340PCT-ND; LEAD_FREE: yes; MF: ON Semi; MOUSER_PART_NUMBER: 512-FDN340P; MPN: FDN340P; PACKAGE: SuperSOT-3; PART_NO: FDN340P; PREFIX: Q; ROHS: yes; TEMPERATURE_RANGE_HIGH: +150°C; TEMPERATURE_RANGE_LOW: -55°C
Q4 Q6 Q8 Q10 = Switches:2N7002P: Nexperia/NXP N-channel Trench MOSFET; DATASHEET: https://upverter.com/datasheet/fb14709cfa772e514417e9088b71c82dd430e406.pdf; DIGIKEY_DESCRIPTION: TRANS; IMPORTED_FROM: octopart; LEAD_FREE: yes; MF: NXP; MFG_PACKAGE_IDENT: TO-236AB; MPN: 2N7002P; NUM_PINS: 3; OCTOPART_PART_NUMBER: 9df555e57fce4232; PACKAGE: SOT23-3; PART_NO: 2N7002P; POLARITY: N-Channel; PREFIX: Q; ROHS: yes; TEMPERATURE_RANGE_HIGH: +150°C; TEMPERATURE_RANGE_LOW: -55°C
R1 = Resistors:R-: Resistor, Surface Mount; MANUFACTURER: Panasonic; MPN: ERJ-2GEJ513X; PART_NO: ERJ-2GEJ513X; TOL: 5%
R2 R3 = Resistors:R-: Resistor, Surface Mount; MANUFACTURER: Panasonic; MPN: ERJ-2GEJ152X; PART_NO: ERJ-2GEJ152X; TOL: 5%
R4 R5 = Resistors:R-: Resistor, Surface Mount; MANUFACTURER: Panasonic; MPN: ERJ-2GEJ472X; PART_NO: ERJ-2GEJ472X; TOL: 5%
R6 = Resistors:R-: Resistor, Surface Mount; MANUFACTURER: Panasonic; MPN: ERJ-2RKF1151X; PART_NO: ERJ-2RKF1151X; TOL: 1%
R7 R46 R47 R49 R202 R204 = Resistors:R-: Resistor, Surface Mount; MANUFACTURER: Panasonic; MPN: ERJ-2GEJ104X; PART_NO: ERJ-2GEJ104X; TOL: 5%
R8 R41 = Resistors:R-: Resistor, Surface Mount; MANUFACTURER: Panasonic; MPN: RC0402JR-07100KL; PART_NO: RC0402JR-07100KL; TOL: 5%
R9 = Resistors:R-: Resistor, Surface Mount; MANUFACTURER: Panasonic; MPN: ERJ-U02J751X; PART_NO: ERJ-U02J751X; TOL: 5%
R10 = Resistors:R-: Resistor, Surface Mount; MANUFACTURER: Panasonic; MPN: ERJ-2GEJ271X; PART_NO: ERJ-2GEJ271X; TOL: 5%
R16 R24 R25 R40 = Resistors:R-: Resistor, Surface Mount; MANUFACTURER: Panasonic; MPN: ERA-2AEB2491X; PART_NO: ERA-2AEB2491X; TOL: 0,1%
R17 R26 R33 R53 = Resistors:R-: Resistor, Surface Mount; MANUFACTURER: Panasonic; MPN: ERA-2AEB103X; PART_NO: ERA-2AEB103X; SPICEPREFIX: R; TOL: 0.1%
R18 R27 R34 R54 = Resistors:R-: Resistor, Surface Mount; MANUFACTURER: Panasonic; MPN: ERJ-2RKF1003X; PART_NO: ERJ-2RKF1003X; TOL: 1%
R19 R28 R35 R55 = Resistors:R-: Resistor, Surface Mount; MANUFACTURER: Panasonic; MPN: ERA-2AEB103X; PART_NO: ERA-2AEB103X; TOL: 0.1%
R20 R29 R36 R56 = Resistors:R-: Resistor, Surface Mount; MANUFACTURER: Panasonic; MPN: ERA-2AEB2491X; PART_NO: ERA-2AEB2491X; TOL: 0.1%
R21 R30 R37 R57 = Resistors:R-: Resistor, Surface Mount; MANUFACTURER: Panasonic; MPN: ERJ-2RKF1002X; PART_NO: ERJ-2RKF1002X; TOL: 1%
R22 R23 R31 R32 R38 R39 R58 R59 = Resistors:R-: Resistor, Surface Mount; MANUFACTURER: Panasonic; MPN: ERJ-3BQF5R1V; PART_NO: ERJ-3BQF5R1V; TOL: 1%
R42 R43 = Resistors:R-: Resistor, Surface Mount; MANUFACTURER: Panasonic; MPN: ERJ-3EKF5101V; PART_NO: ERJ-3EKF5101V; TOL: 5%
R48 = Resistors:R-: Resistor, Surface Mount; MANUFACTURER: Panasonic; MPN: ERJ-2RKF1202X; PART_NO: ERJ-2RKF1202X; TOL: 1%
R101 R102 = Resistors:R-: Resistor, Surface Mount; MANUFACTURER: Panasonic; MPN: ERJ-2GEJ390X; PART_NO: ERJ-2GEJ390X; TOL: 5%
R103 = Resistors:R-: Resistor, Surface Mount; MANUFACTURER: Panasonic; MPN: ERJ-2GEJ682X; PART_NO: ERJ-2GEJ682X; TOL: 5%
R201 = Resistors:R-: Resistor, Surface Mount; MANUFACTURER: Panasonic; MPN: ERJ-2GEJ274X; PART_NO: ERJ-2GEJ274X; TOL: 5%
R203 = Resistors:R-: Resistor, Surface Mount; MANUFACTURER: Panasonic; MPN: ERJ-2GEJ202X; PART_NO: ERJ-2GEJ202X; TOL: 5%
R206 = Resistors:R-: Resistor, Surface Mount; MANUFACTURER: Panasonic; MPN: ERJ-2GEJ103X; PART_NO: ERJ-2GEJ103X; TOL: 5%
R.GND = Resistors:R-: Resistor, Surface Mount; MPN: ERJ-S1D0R00U; PART_NO: ERJ-S1D0R00U
S201 = Switches:SLIDESWITCH-SPDT: Single Pole, Double Throw (SPDT) Switch Single-pole, double-throw (SPDT) switch. Variant Overview SMD-AYZ0202 Surface Mount DPDT Switch <https://www.sparkfun.com/products/597> (COM-00597) Used on e.g. LilyPad Arduino USB - ATmega32U4 Board <https://www.sparkfun.com/products/12049> PTH-11.6X4.0MM SPDT Mini Power Switch <https://www.sparkfun.com/products/102> (COM-00102) Used on e.g. SparkFun Simon Says - Through-Hole Soldering Kit <https://www.sparkfun.com/products/10547> (KIT-10547) PTH-11.6X4.0MM-KIT KIT version of SPDT Mini Power Switch - Simplifies soldering by removing tStop of switch pins - only one side can be soldered. PTH-11.6X4.0MM-LOCK LOCK version of SPDT Mini Power Switch - Offset pins hold switch in place for easier soldering. SMD-RIGHT-ANGLE Surface Mount Right Angle Switch <https://www.sparkfun.com/products/10860> (COM-10860) Used on e.g. SparkFun ESP8266 Thing <https://www.sparkfun.com/products/13231>; MANUFACTURER: Nidec Copal Electronics; MPN: CUS-12TB; PART_NO: CUS-12TB
S.ERASE S.NRST = Switches:MOMENTARY-SWITCH-SPST: Momentary Switch (Pushbutton) - SPST Normally-open (NO) SPST momentary switches (buttons, pushbuttons). Variants PTH-12MM - 12mm square, through-hole Momentary Pushbutton Switch - 12mm Square <https://www.sparkfun.com/products/9190> (COM-09190) PTH-6.0MM, PTH-6.0MM-KIT - 6.0mm square, through-hole Mini Pushbutton Switch <https://www.sparkfun.com/products/97> (COM-00097) KIT package intended for soldering kit's - only one side of pads' copper is exposed. PTH-RIGHT-ANGLE-KIT - Right-angle, through-hole Right Angle Tactile Button <https://www.sparkfun.com/products/10791> - Used on SparkFun BigTime Watch Kit <https://www.sparkfun.com/products/11734> SMD-12MM - 12mm square, surface-mount Tactile Button - SMD (12mm) <https://www.sparkfun.com/products/12993> (COM-12993) Used on SparkFun PicoBoard <https://www.sparkfun.com/products/11888> SMD-4.5MM - 4.5mm Square Trackball Switch Used on SparkFun Blackberry Trackballer Breakout <https://www.sparkfun.com/products/13169> SMD-4.6MMX2.8MM - 4.60mm x 2.80mm, surface mount Used on SparkFun SAMD21 Mini Breakout <https://www.sparkfun.com/products/13664> SMD-5.2MM, SMD-5.2-REDUNDANT - 5.2mm square, surface-mount Mini Pushbutton Switch - SMD <https://www.sparkfun.com/products/8720> (COM-08720) Used on Arduino Pro Mini <https://www.sparkfun.com/products/11114> REDUNDANT package connects both switch circuits together SMD-6.0X3.5MM - 6.0 x 3.5mm, surface mount Momentary Reset Switch SMD <https://www.sparkfun.com/products/8229> (COM-08229) SMD-6.2MM-TALL - 6.2mm square, surface mount Tactile Button - SMD (6mm) <https://www.sparkfun.com/products/12992> Used on SparkFun Digital Sandbox <https://www.sparkfun.com/products/12651> SMD-RIGHT-ANGLE - Right-angle, surface mount Used on SparkFun Block for Intel® Edison - Arduino <https://www.sparkfun.com/products/13036>; MP: RS-187R05A2-DS MT RT; MPN: RS-187R05A2-DS MT RT; PART_NO: RS-187R05A2-DS MT RT; PROD_ID: COMP-12265; SF_SKU: COM-12993
STAT2 = Diodes:LED: LED OSRAM: - CHIPLED LG R971, LG N971, LY N971, LG Q971, LY Q971, LO R971, LY R971 LH N974, LH R974 LS Q976, LO Q976, LY Q976 LO Q996 - Hyper CHIPLED LW Q18S LB Q993, LB Q99A, LB R99A - SideLED LS A670, LO A670, LY A670, LG A670, LP A670 LB A673, LV A673, LT A673, LW A673 LH A674 LY A675 LS A676, LA A676, LO A676, LY A676, LW A676 LS A679, LY A679, LG A679 - Hyper Micro SIDELED® LS Y876, LA Y876, LO Y876, LY Y876 LT Y87S - SmartLED LW L88C, LW L88S LB L89C, LB L89S, LG L890 LS L89K, LO L89K, LY L89K LS L896, LA L896, LO L896, LY L896 - TOPLED LS T670, LO T670, LY T670, LG T670, LP T670 LSG T670, LSP T670, LSY T670, LOP T670, LYG T670 LG T671, LOG T671, LSG T671 LB T673, LV T673, LT T673, LW T673 LH T674 LS T676, LA T676, LO T676, LY T676, LB T676, LH T676, LSB T676, LW T676 LB T67C, LV T67C, LT T67C, LS T67K, LO T67K, LY T67K, LW E67C LS E67B, LA E67B, LO E67B, LY E67B, LB E67C, LV E67C, LT E67C LW T67C LS T679, LY T679, LG T679 LS T770, LO T770, LY T770, LG T770, LP T770 LB T773, LV T773, LT T773, LW T773 LH T774 LS E675, LA E675, LY E675, LS T675 LS T776, LA T776, LO T776, LY T776, LB T776 LHGB T686 LT T68C, LB T68C - Hyper Mini TOPLED® LB M676 - Mini TOPLED Santana® LG M470 LS M47K, LO M47K, LY M47K Source: http://www.osram.convergy.de/; COLOR: Yellow; MP: LY Q396-P1Q2-36; MPN: LY Q396-P1Q2-36; PART_NO: LY Q396-P1Q2-36
U1 = Regulators:AP2120N; MPN: AP2120N-3.3TRG1; PART_NO: AP2120N-3.3TRG1
U2 = Regulators:TLV1117LV33DCYR: TI TLV1117LV33DCYR 3.3V LDO Regulator; BUILT_BY: EMA_UL_Team; MANUFACTURER: Texas Instruments; MANUFACTURER_PART_NUMBER: TLV1117LV33DCYR; MPN: TLV1117LV33DCYR; PART_NO: TLV1117LV33DCYR; VENDOR: Texas Instruments
U3 = Diodes:ESD122DMYR: ESD Protection Diode Pair; MANUFACTURER: Texas Instruments; MP: ESD122DMYR; MPN: ESD122DMYR; PARTNUMBER: ESD122DMYR; PART_NO: ESD122DMYR
U5 U7 U9 U14 = Amplifiers:INA225AIDGK: Texas Instruments INA335AIDGK Differential Amplifier with 4-option programmable gain Datasheet: https://www.ti.com/lit/ds/symlink/ina225.pdf?ts=1590715773259; BUILT_BY: EMA_UL_Team; MANUFACTURER_PART_NUMBER: INA225AIDGKT; MPN: INA225AIDGKT; PART_NO: INA225AIDGKT; VENDOR: Texas Instruments
U6 U8 U10 U15 = Amplifiers:OPA357AIDBVTG4: TI-OPA357AIDBVTG4 Operational Amplifier Datasheet: https://www.ti.com/lit/ds/symlink/opa2357.pdf?HQS=TI-null-null-digikeymode-df-pf-null-wwe&ts=1590718557501; 2ND_HARMONICDBC: 75; 3RD_HARMONICDBC: 83; ACL_MIN_STABLE_GAINVV: 1; BW__ACLMHZ: 250; CIIVA_IDS: 1333678; CODE__JEDEC: MO-178; COMPONENT_LINK_1_DESCRIPTION: Manufacturer URL; COMPONENT_LINK_1_URL: http://www.ti.com/; COMPONENT_LINK_3_DESCRIPTION: Package Specification; COMPONENT_LINK_3_URL: http://www.ti.com/litv/pdf/mpds026h; DATASHEET: http://www.ti.com/general/docs/lit/getliterature.tsp?genericPartNumber=OPA357&fileType=pdf; DATASHEET_VERSION: SBOS235E; DIFF_GAIN: 0.02; DIFF_PHASEDEG: 0.09; FOOTPRINT_VARIANT_NAME_0: Level C; FOOTPRINT_VARIANT_NAME_1: Level B; FOOTPRINT_VARIANT_NAME_2: Level A; IIB_MAXN_A: 0.05; IMPORTED: yes; IMPORTED_FROM: vault; IMPORT_TS: 1521853826; IO_TYPM_A: 100; IQ_PER_CHANNELMAXMA: 7.5; MF: Texas Instruments; MHZ: 1; MOUNTING_TECHNOLOGY: Surface Mount; MPN: OPA357AIDBVTG4; NUMBER_OF_CHANNELS: 1; PACKAGE: DBV6; PACKAGE_DESCRIPTION: 6-Pin Plastic Small Outline, Body 1.6 x 2.9 mm, Pitch 0.95 mm; PACKAGE_VERSION: 4073253-5/K, 03/2006; PART_NO: OPA357AIDBVTG4; PREFIX: U; RAIL__RAIL: In, Out; RELEASE_DATE: 1370004439; ROHS: Yes; SETTLING_TIME_01TYPNS: 30; SLEW_RATETYPVUS: 150; SUB_FAMILY: High Output Current Amplifier (>=50mA), High Speed Amplifier (>=50MHz), Low Supply Voltage Amplifier (<=2.7V); THD_FC_IS_1_MHZTYPDB: -74; VAULT_GUID: CB56EDB0-23E6-4CBA-8F03-D217D127685E; VAULT_REVISION: BD2B64F2-B79F-4C97-B6D3-B17A72B69E93; VIO_MAXM_V: 8; VN_AT_FLATBANDTYPNVRTHZ: 6.5; VS_MAX_V: 5.5; VS_MIN_V: 2.5
U11 = DACs:DAC7574IDGS: TI DAC7574, Quad, 12-bit digital-to-analog converter with I2C interface datasheet: https://www.ti.com/lit/ds/symlink/dac7574.pdf?ts=1591470520597; DATASHEET_URL: http://www.ti.com/lit/gpn/DAC7574; DESCRIPTION: 12-Bit Quad Voltage Output Digital-to-Analog Converter w/ I2C Interface; FAMILY_NAME: PRECISION DAC (=<10MSPS); GENERIC_PART_NUMBER: DAC7574; INDUSTRY_STD_PKG_TYPE: MSOP; MANUFACTURER: Texas Instruments; MANUFACTURER_PART_NUMBER: DAC7574IDGS; MPN: DAC7574IDGS; PACKAGE_DESIGNATOR: DGS; PART_NO: DAC7574IDGS; PIN_COUNT: 10; VENDOR: Texas Instruments
U12 = Chargers:MCP73871T-2CCI/ML: IC USB/AC BATT CHRGR W/PPM 20QFN; DESCRIPTION: Fully Integrated Single Cell Lithium Ion/Lithium Polymer Charge Management Contr; DIGI-KEY_PART_NUMBER: MCP73871T-2CCI/MLCT-ND; DIGI-KEY_PURCHASE_URL: https://www.digikey.com/product-detail/en/microchip-technology/MCP73871T-2CCI-ML/MCP73871T-2CCI-MLCT-ND/7065594?utm_source=snapeda&utm_medium=aggregator&utm_campaign=symbol; MF: Microchip; MP: MCP73871T-2CCI/ML; MPN: MCP73871T-2CCI/ML; PACKAGE: QFN-20 Microchip; PART_NO: MCP73871T-2CCI/ML
U13 = Switches:USB2412-DZK; BUILT_BY: EMA_Jessica; COPYRIGHT: Copyright (C) 2018 Accelerated Designs. All rights reserved; MANUFACTURER_PART_NUMBER: USB2412-DZK; MPN: USB2412-DZK; PART_NO: USB2412-DZK; SOURCELIBRARY: Microchip_2019-08-23_1; VENDOR: Microchip
U204 = Switches:LOADSWITCH-MIC9416: Micrel 3A High-side Load Switch with Reverse Blocking http://ww1.microchip.com/downloads/en/DeviceDoc/MIC9416x.pdf https://www.digikey.com/product-detail/en/microchip-technology/MIC94162YCS-TR/576-4508-1-ND/4732487; MANUFACTURER: Microchip Technology; MPN: MIC94164YCS-TR; PART_NO: MIC94164YCS-TR; PART_NUMBER: MIC94164; QUENCH: YES; SOFTSTART: YES
U.IP = Processors:ATSAM3X8EA: ATSAM3X8EA ARM-based Flash MCU; MANUFACTURER: Atmel; MP: ATSAM3X8EAAU; MPN: ATSAM3X8EAAU; PART_NO: ATSAM3X8EAAU
UART.VCC = Connectors:JUMPER-SMT_2_NO_PASTEFREE: Normally open solder jumper This jumper has an aperture in the stencil to allow solder paste to bridge the split in the wire but it is normally open (NC). Apply solder to close the connection.
VR3 VR4 = Diodes:VARISTOR: Varistor; MANUFACTURER: Bourns; MPN: CG0603MLC-05E; PART_NO: CG0603MLC-05E
VREG.SEL = Connectors:JUMPER-SMT_3_1-NC_PASTE: Normally closed solder jumper (1 of 2 connections) This jumper has an aperture in the stencil to allow solder paste to bridge one of the two connections. One connection is normally closed (NC), while the other is normally open (NO). Wick off the solder to open the connection. Reapply solder to reclose the connection. Apply solder to the other side instead to change the current path.
Y1 = Oscillators:EPSON_TSX-3225_24.0000MF10Z-C3; BUILT_BY: EMA_Matt; COPYRIGHT: Copyright (C) 2018 Accelerated Designs. All rights reserved; MANUFACTURER_PART_NUMBER: TSX-3225 24.0000MF10Z-C3; MPN: TSX-3225 24.0000MF10Z-C3; PART_NO: TSX-3225 24.0000MF10Z-C3; VENDOR: Epson
Y101 = Oscillators:CRYSTAL: Crystal; MANUFACTURER: ECS Inc.; MPN: ECS-.327-12.5-34B-TR; PART_NO: ECS-.327-12.5-34B-TR
Y102 = Oscillators:0396_12MHZ-12PF-K7: Crystal; MANUFACTURER: Abracon; MPN: ABM8G-12.000MHZ-4Y-T3; PART_NO: ABM8G-12.000MHZ-4Y-T3; VALUE: 12mHz-12pF-K7

## Net classes
1 power: width 0.254 mm
2 power_5: width 0.254 mm
5 10_mil: width 0.254 mm
8 GND: width 0.127 mm